# EAGLE board GC_LINE_2026_INCHEON (EAGLE 9.7.0), part 1 of 2
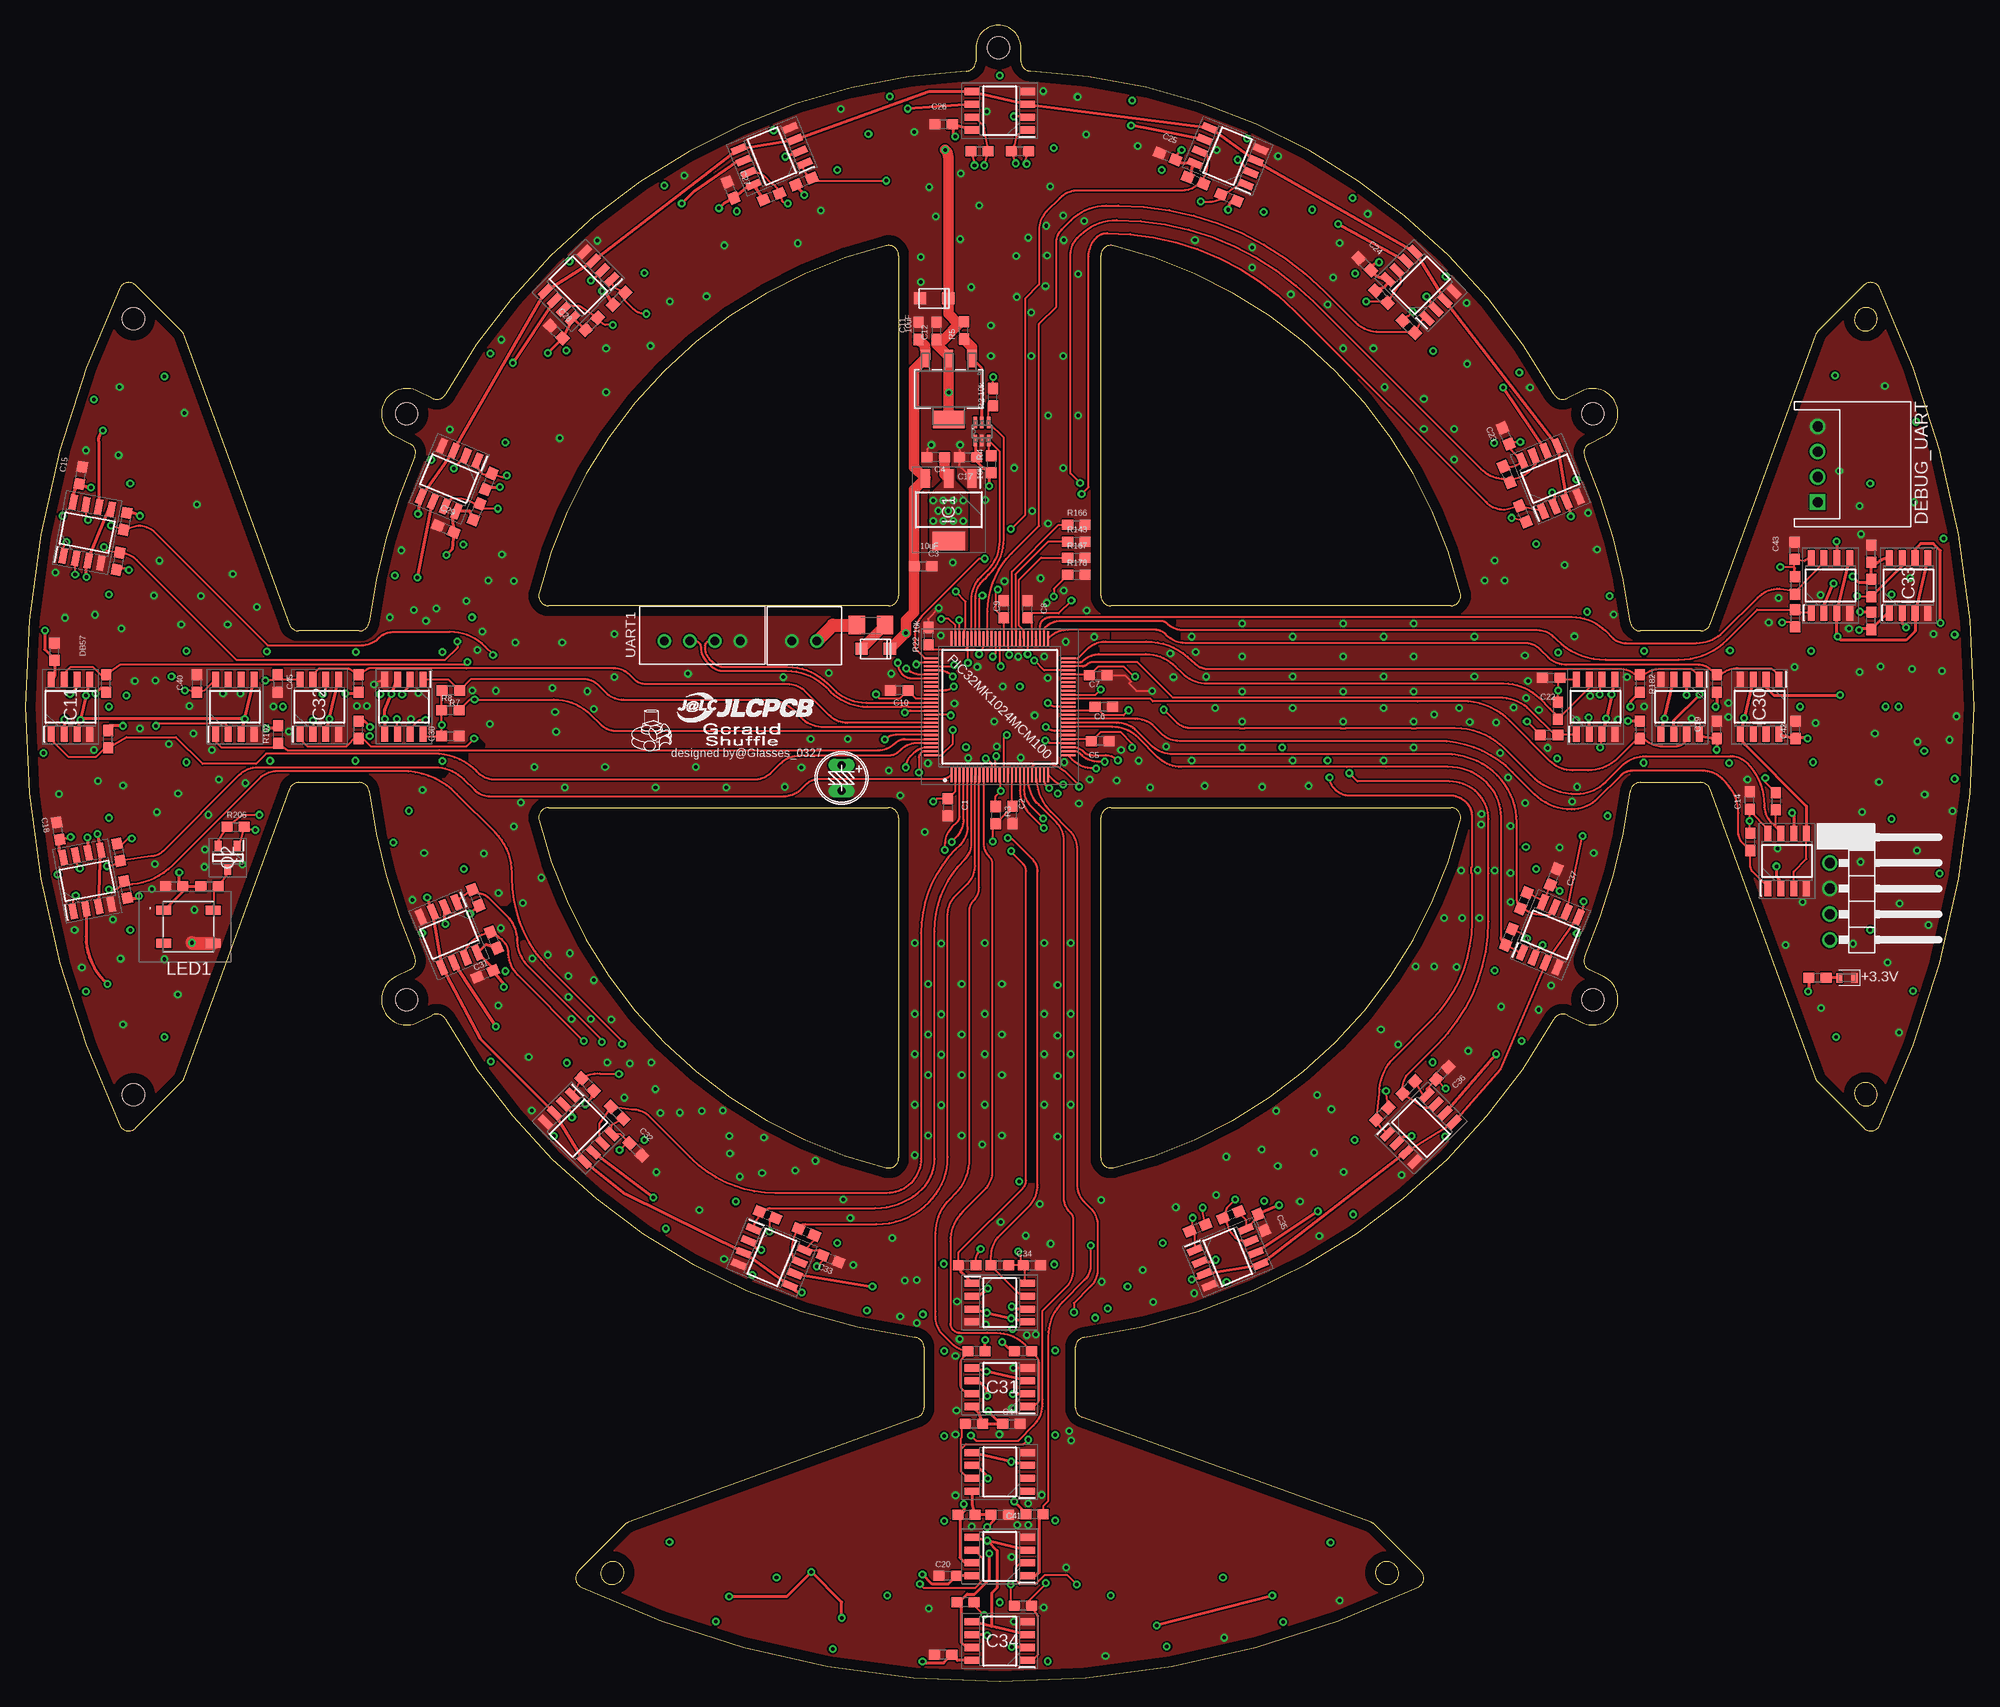
[diagram p5: board, top side]
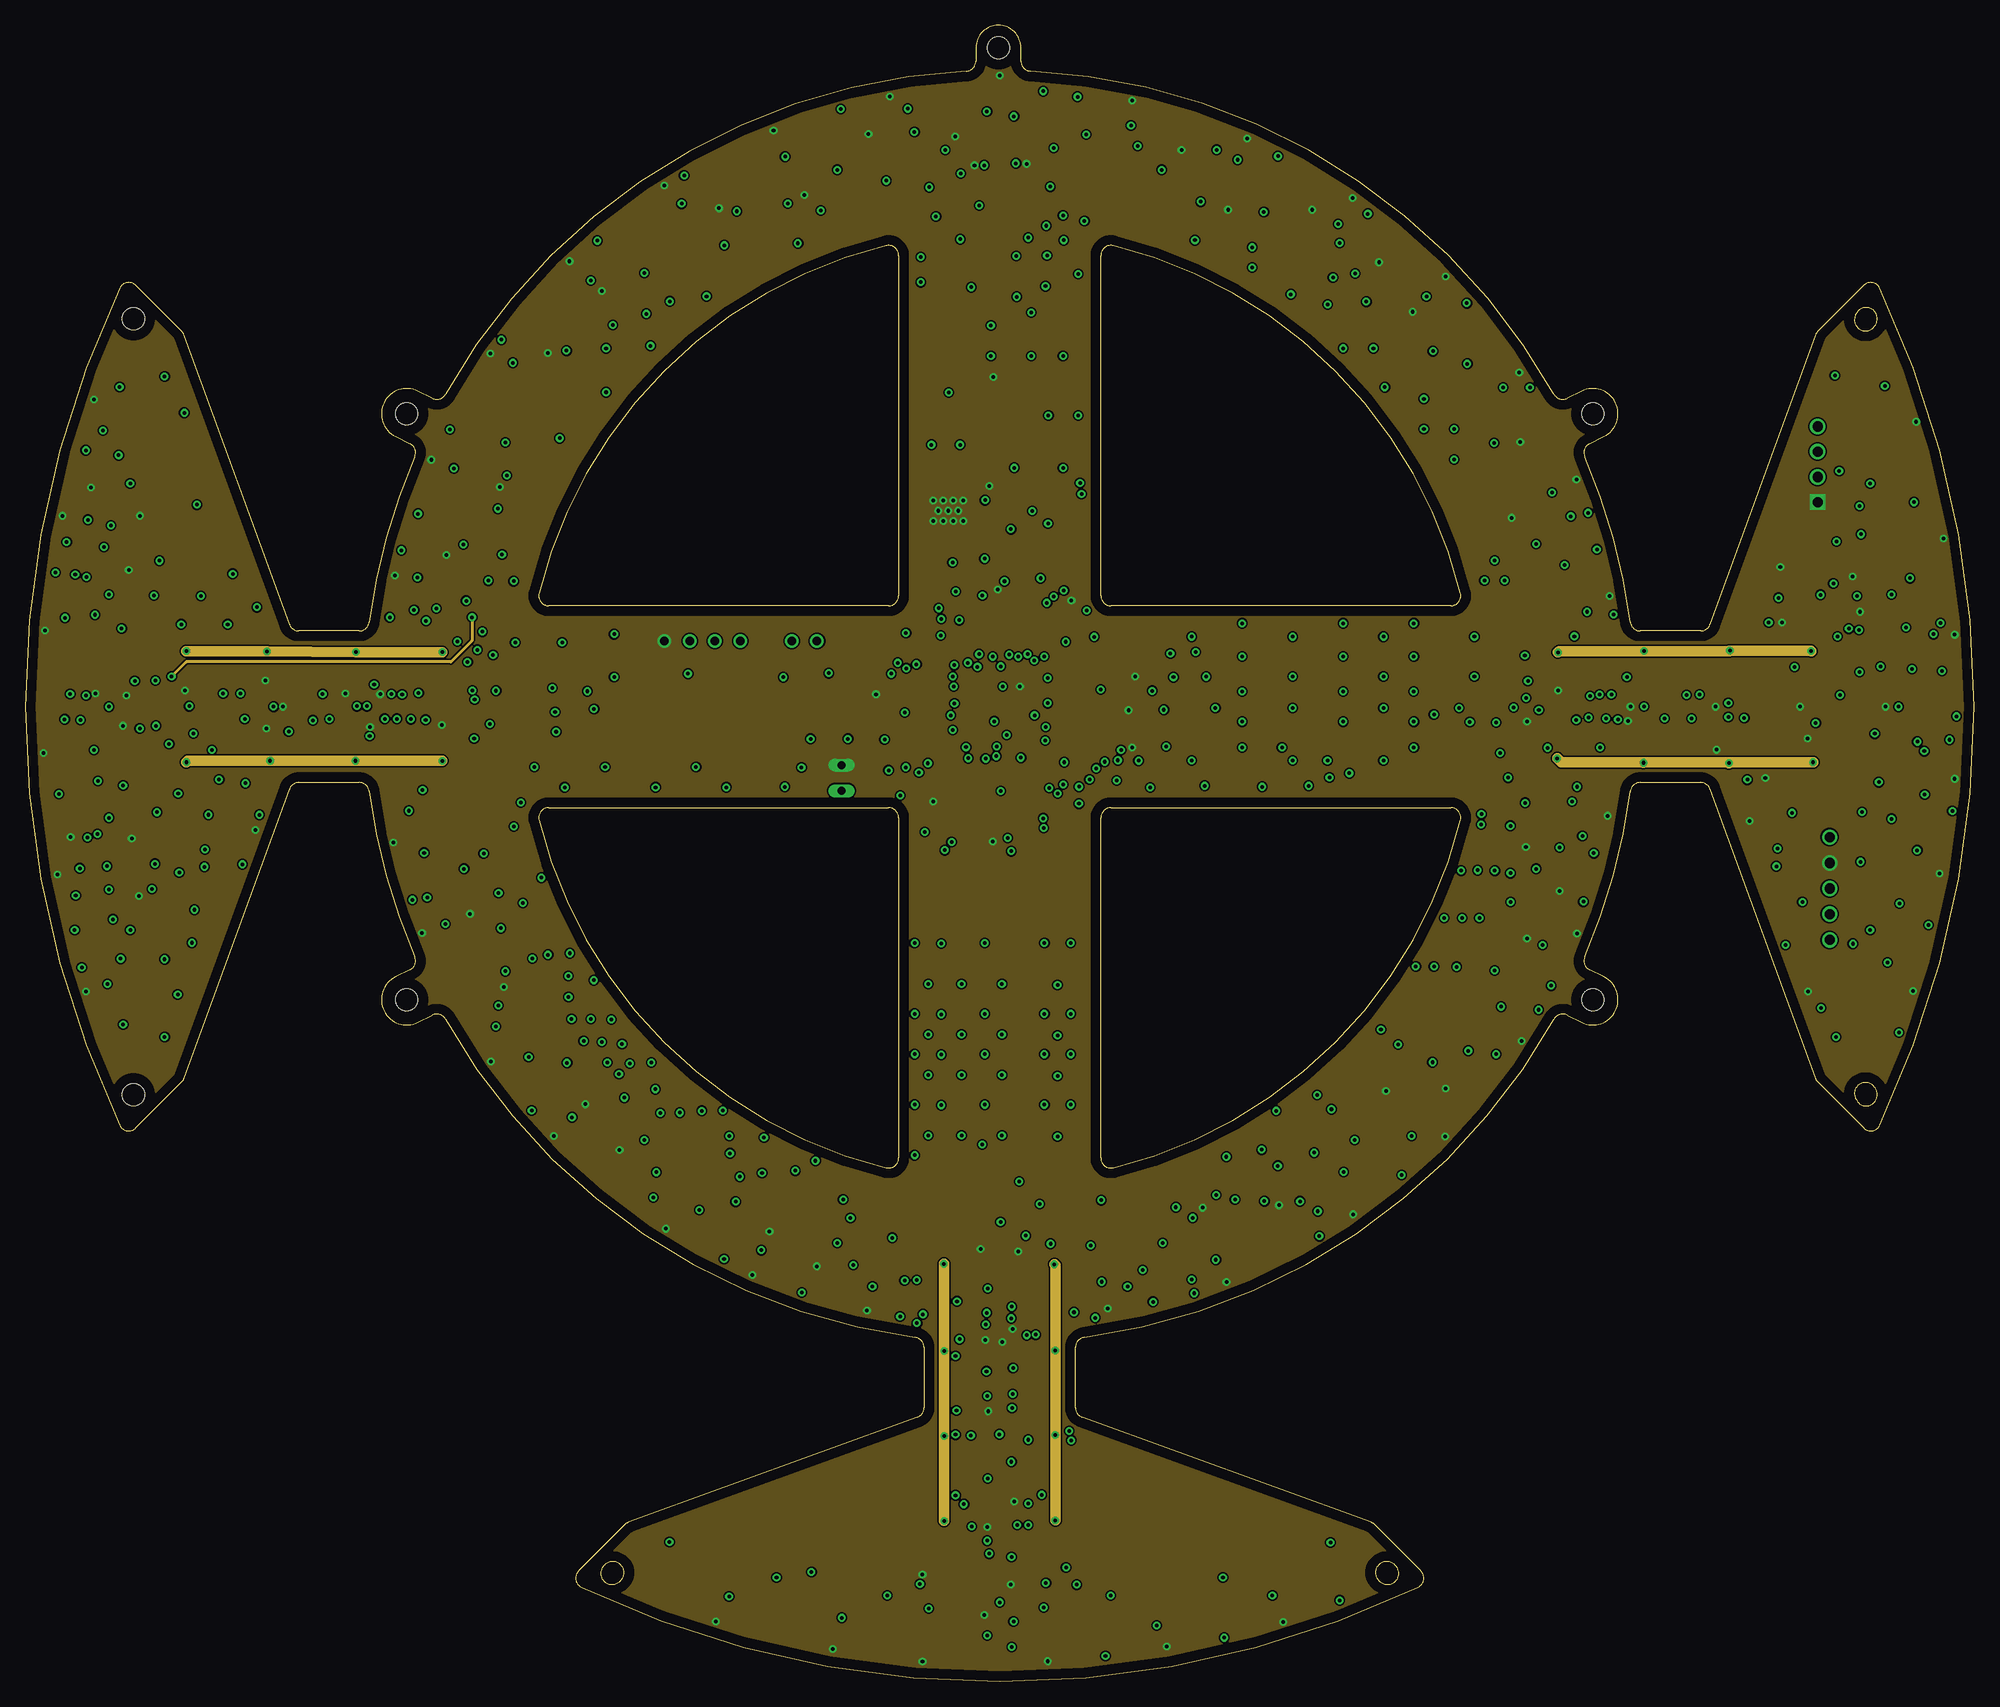
[diagram p6: board, inner layer Route2]
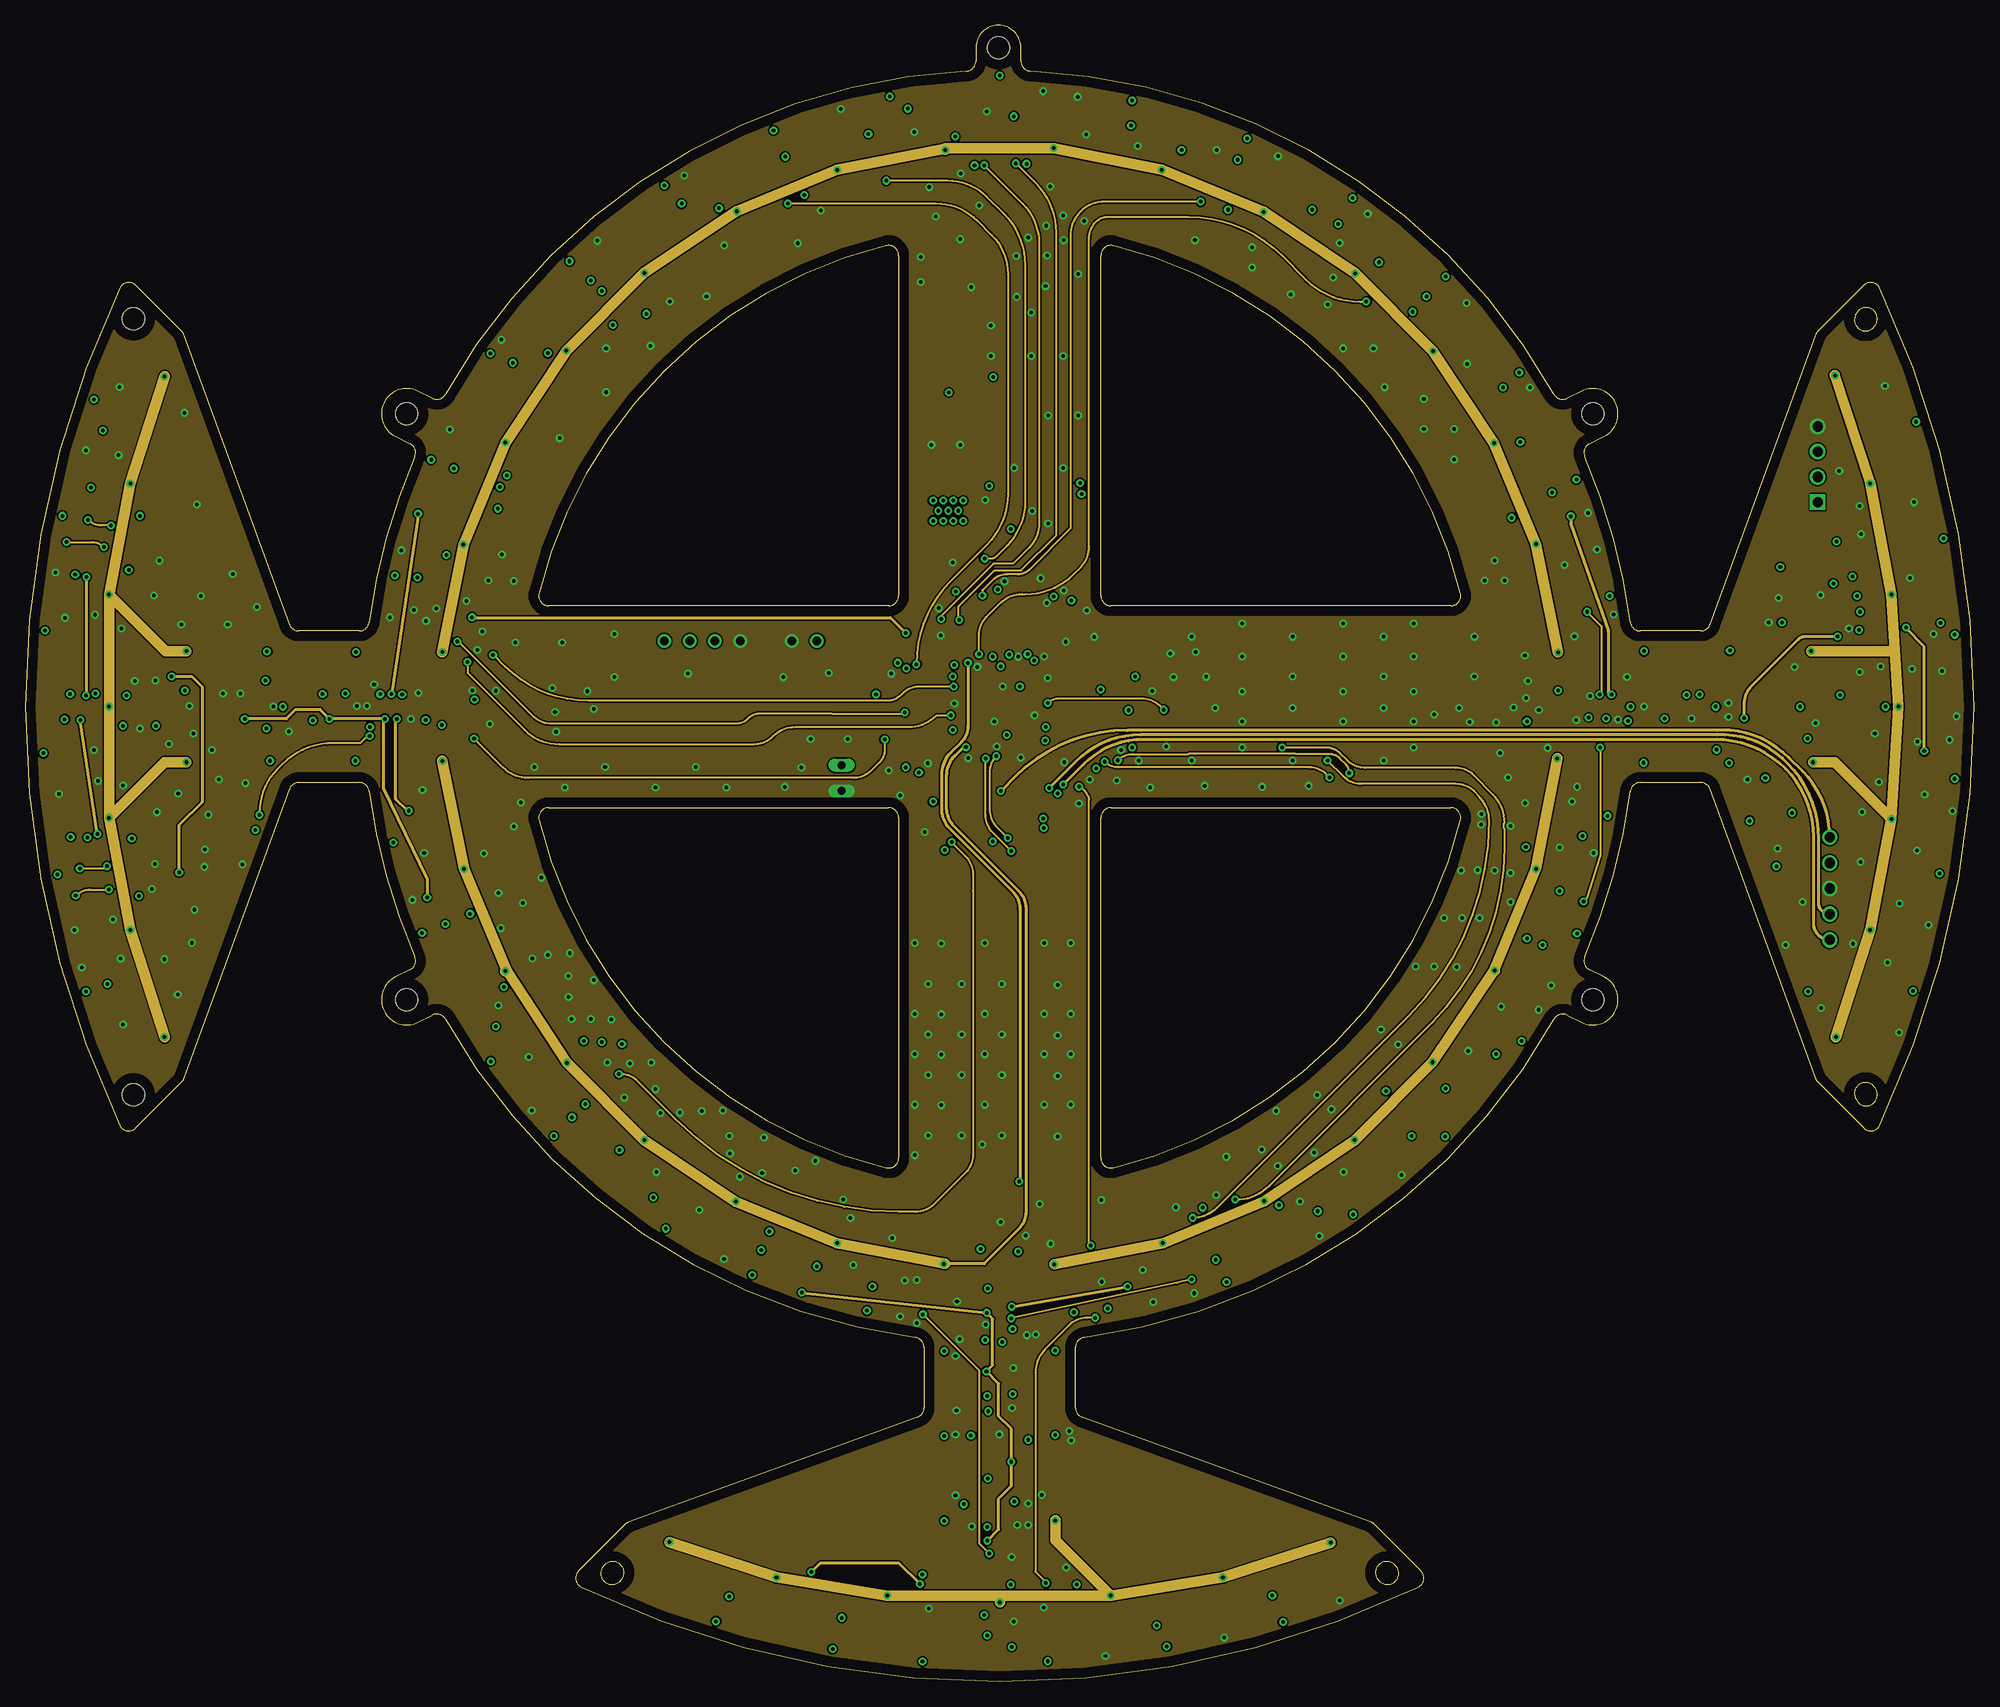
[diagram p7: board, inner layer Route15]
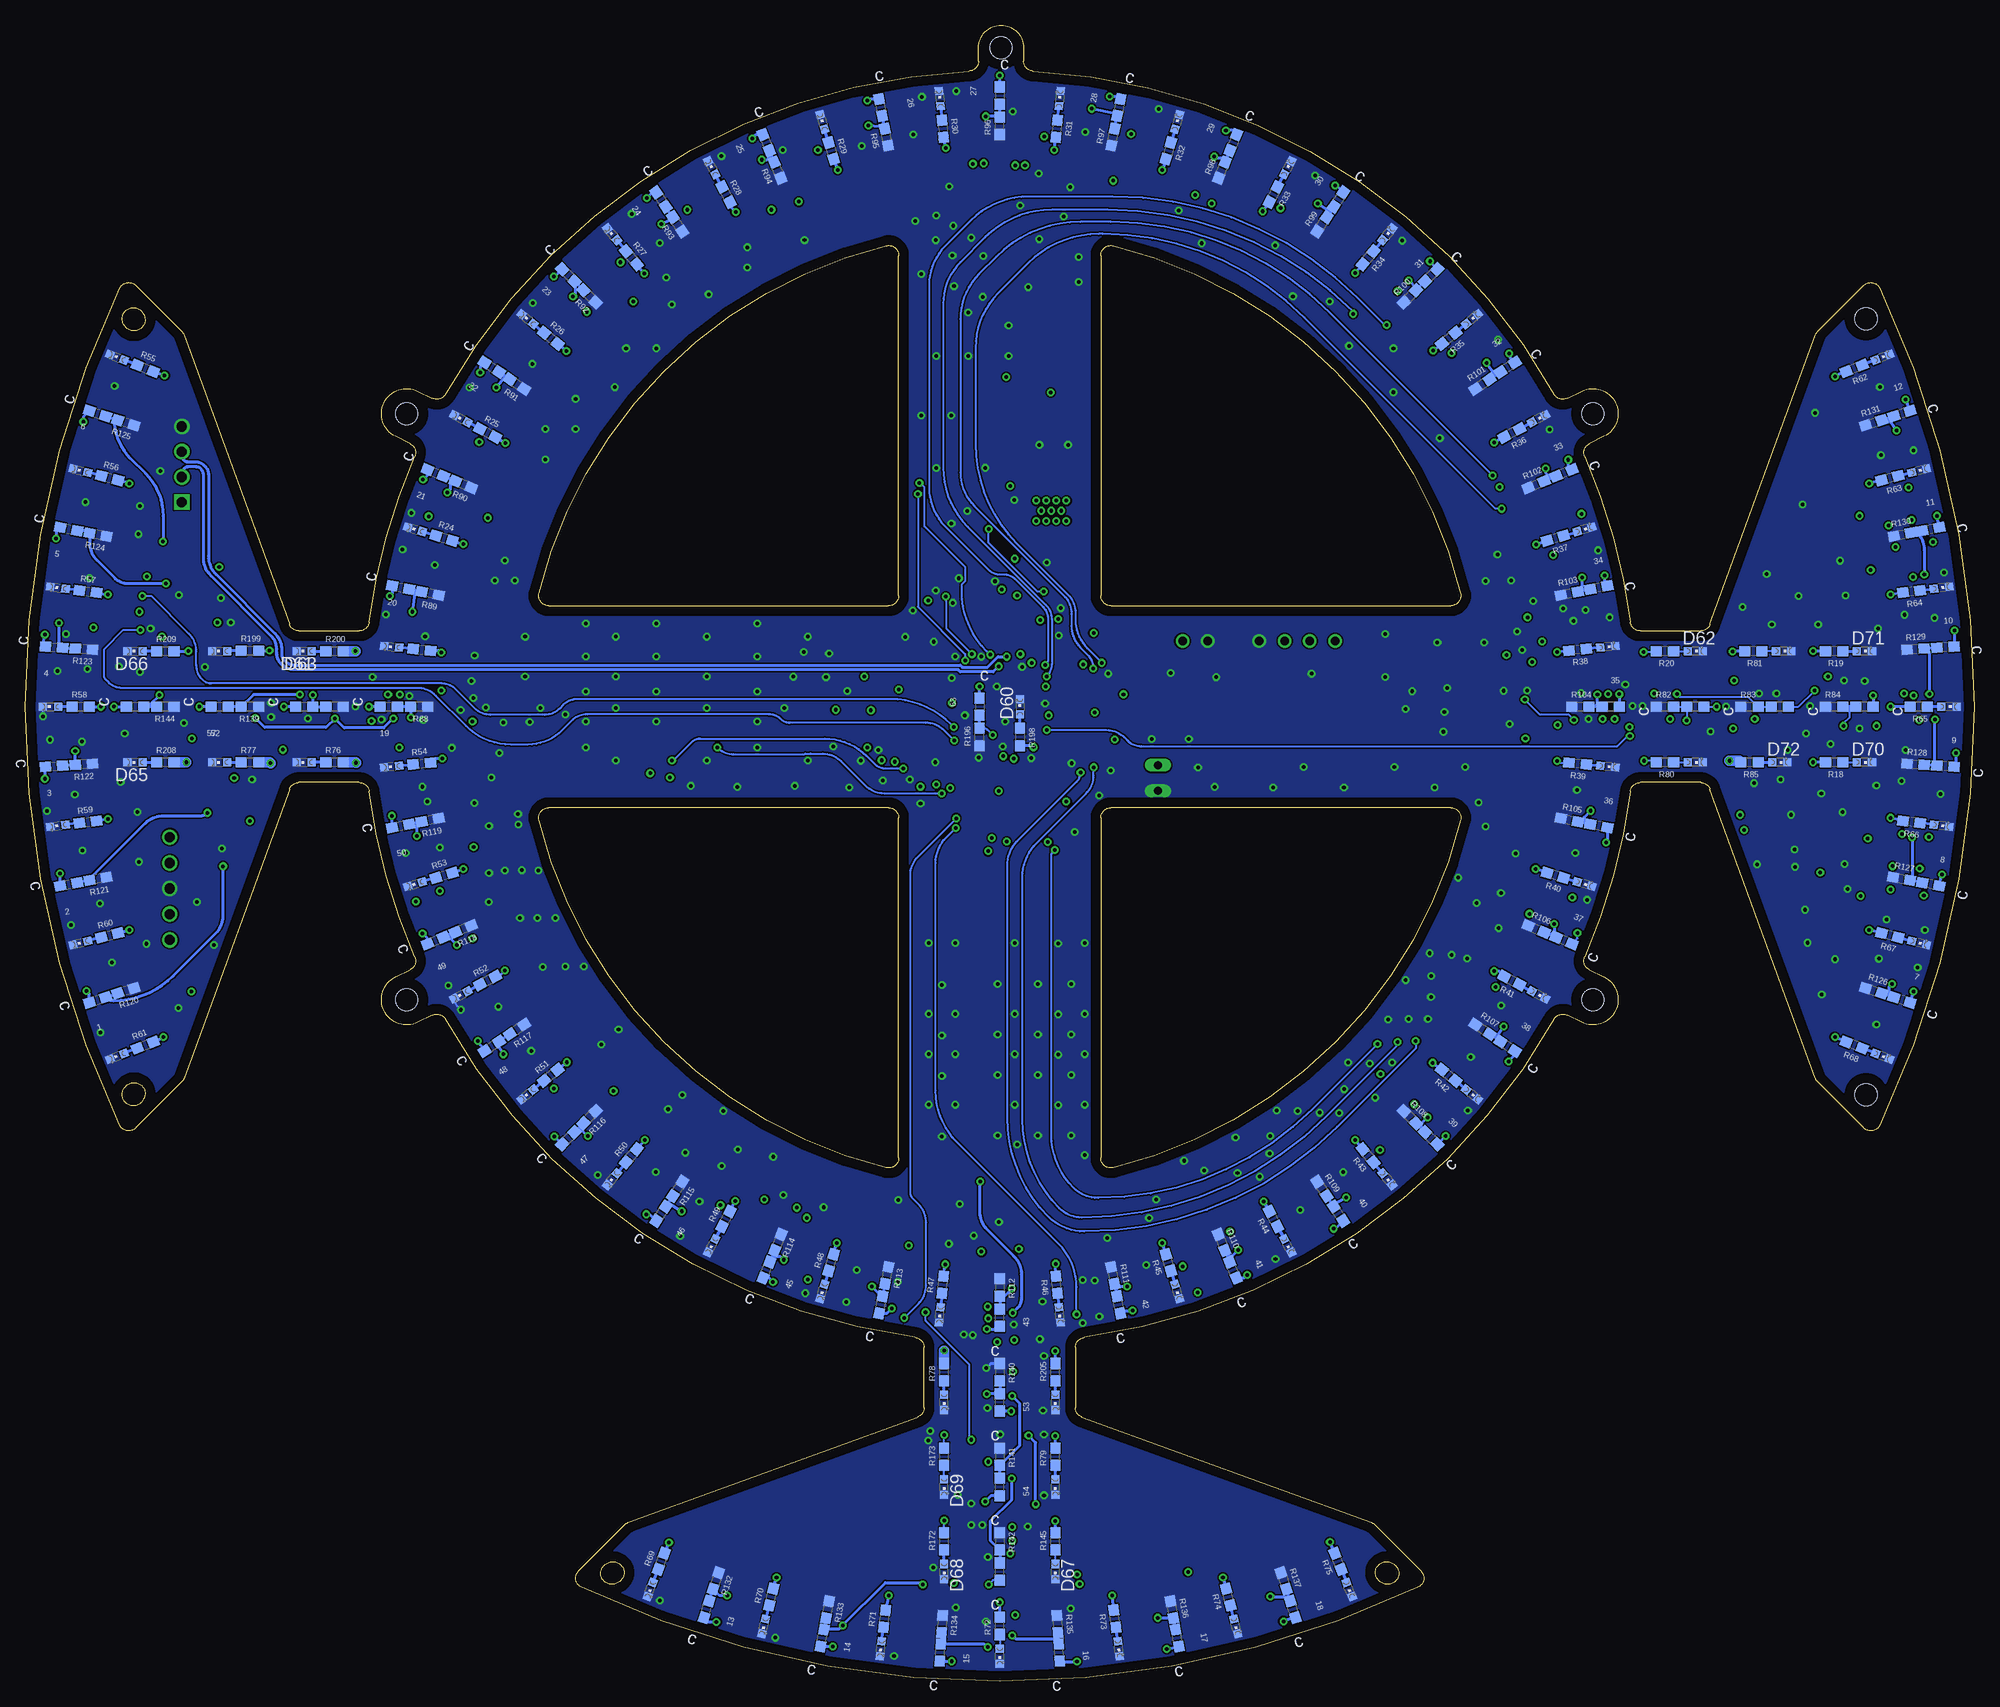
[diagram p8: board, bottom side, seen from below]

Size 193 x 163.96 mm. Coordinates in mm from the lower left corner, seen from the top.
Outline: 138.2,10.95 133.65,15.51 arc25 133.29,15.74 104.66,26.16 arc-70 104,27.1 104,33.07 arc-82 104.87,34.06 arc53 151.38,65.56 arc-87 152.69,65.96 154.12,65.26 arc180 156.34,69.74 154.91,70.45 arc-87 154.43,71.74 arc16 158.94,88.13 arc-82 159.93,89 165.9,89 arc-70 166.84,88.34 177.26,59.71 arc25 177.49,59.35 182.04,54.79 arc110 183.65,55.07 arc51 183.65,137.93 arc110 182.04,138.2 177.49,133.65 arc25 177.26,133.29 166.84,104.66 arc-70 165.9,104 159.93,104 arc-82 158.94,104.87 arc16 154.43,121.26 arc-87 154.91,122.55 156.34,123.26 arc180 154.12,127.74 152.69,127.03 arc-87 151.38,127.44 arc58 99.55,159.43 arc-87 98.6,160.42 98.6,161.73 arc180 94.13,161.73 94.13,160.41 arc-87 93.19,159.41 arc58 41.62,127.44 arc-87 40.31,127.03 38.88,127.74 arc180 36.66,123.26 38.09,122.55 arc-87 38.57,121.26 arc16 34.06,104.87 arc-82 33.07,104 27.1,104 arc-70 26.16,104.66 15.74,133.29 arc25 15.51,133.65 10.95,138.2 arc110 9.34,137.93 arc51 9.34,55.07 arc110 10.95,54.79 15.51,59.35 arc25 15.74,59.71 26.16,88.34 arc-70 27.1,89 33.07,89 arc-82 34.06,88.13 arc16 38.57,71.74 arc-87 38.09,70.45 36.66,69.74 arc180 38.88,65.26 40.31,65.96 arc-87 41.62,65.56 arc53 88.13,34.06 arc-82 89,33.07 89,27.1 arc-70 88.34,26.16 59.71,15.74 arc25 59.35,15.51 54.79,10.95 arc110 55.07,9.34 arc51 137.93,9.34 arc110 138.2,10.95
Outline: 107.5,86.5 arc90 106.5,85.5 106.5,51.83 arc104 107.74,50.86 arc62 142.14,85.26 arc104 141.16,86.5 107.5,86.5
Outline: 58.66,9.77 arc187 57.62,11.7 arc187 58.66,9.77
Outline: 181.3,57.62 arc187 183.23,58.66 arc187 181.3,57.62
Outline: 134.34,9.77 arc187 135.38,11.7 arc187 134.34,9.77
Outline: 141.16,106.5 arc104 142.14,107.74 arc62 107.74,142.14 arc104 106.5,141.16 106.5,107.5 arc90 107.5,106.5 141.16,106.5
Outline: 86.5,85.5 arc90 85.5,86.5 51.83,86.5 arc104 50.86,85.26 arc62 85.26,50.86 arc104 86.5,51.83 86.5,85.5
Outline: 183.23,134.34 arc187 181.3,135.38 arc187 183.23,134.34
Outline: 85.5,106.5 arc90 86.5,107.5 86.5,141.16 arc104 85.26,142.14 arc62 50.86,107.74 arc104 51.83,106.5 85.5,106.5
Copper layers (1+2*15+16): Top 0.035mm / dielectric 1.5mm / Route2 0.035mm / dielectric 0.15mm / Route15 0.035mm / dielectric 0.2mm / Bottom 0.035mm
Design rules "Fusion Electronics Design Rules *": minimum track width 6mil, minimum drill 0.35mm, track to track 6mil, track to pad 6mil, pad to pad 6mil, via to via 6mil, smd to smd 6mil, copper to edge 40mil, drill to drill 6mil, minimum pad ring 10mil, minimum via ring 8mil, stop-mask expansion 4mil, vias tented up to drill 0.36mm, thermal gap 10mil
Holes 2.2 mm at 155.23,125.5 155.23,67.5 10.71,134.92 37.77,125.5 96.37,161.73 37.77,67.5 10.71,58.08
tRestrict: 18 lines

## Footprints (pad centres in the part's own frame; a part is rotated, then mirrored left to right if it is on the bottom)
C1608 = smd 1.1 x 1: 1 -0.85,0; 2 0.85,0
LEDC1608X55N_FLAT-R = smd 0.612 x 0.912: A 0.75,0; C -0.75,0
CC:3 = drill 0.8 long: + -1.27,0; - 1.27,0
CHIPLED_0603 = smd 0.8 x 0.8: A 0,-0.75; C 0,0.75
S4B-XH-A = drill 1.016 square: 1 3.75,0 | drill 1.016: 2 1.25,0; 3 -1.25,0; 4 -3.75,0
SOT230P700X180-4N = smd 1.85 x 0.9: 1 -3.1,2.3; 2 -3.1,0; 3 -3.1,-2.3 | smd 1.85 x 3.2: 4 3.1,0
SOIC127P600X175-8N = smd 0.7 x 1.525: 1 -1.905,-2.712; 2 -0.635,-2.712; 3 0.635,-2.712; 4 1.905,-2.712; 5 1.905,2.712; 6 0.635,2.712; 7 -0.635,2.712; 8 -1.905,2.712
B2B-XH-A = drill 0.84: 1 0,0; 2 2.5,0
WS2812BB = smd 1.5 x 0.9: 1 -2.45,1.65; 2 -2.45,-1.65; 3 2.45,-1.65; 4 2.45,1.65
1X05L = drill 1.016: 1 -5.08,-3.81; 2 -2.54,-3.81; 3 0,-3.81; 4 2.54,-3.81; 5 5.08,-3.81
QFP40P1400X1400X120-100N = smd 1.475 x 0.2: 1 -6.738,4.8; 2 -6.738,4.4; 3 -6.738,4; 4 -6.738,3.6; 5 -6.738,3.2; 6 -6.738,2.8; 7 -6.738,2.4; 8 -6.738,2; 9 -6.738,1.6; 10 -6.738,1.2; 11 -6.738,0.8; 12 -6.738,0.4; 13 -6.738,0; 14 -6.738,-0.4; 15 -6.738,-0.8; 16 -6.738,-1.2; 17 -6.738,-1.6; 18 -6.738,-2; 19 -6.738,-2.4; 20 -6.738,-2.8; 21 -6.738,-3.2; 22 -6.738,-3.6; 23 -6.738,-4; 24 -6.738,-4.4; 25 -6.738,-4.8; 51 6.738,-4.8; 52 6.738,-4.4; 53 6.738,-4; 54 6.738,-3.6; 55 6.738,-3.2; 56 6.738,-2.8; 57 6.738,-2.4; 58 6.738,-2; 59 6.738,-1.6; 60 6.738,-1.2; 61 6.738,-0.8; 62 6.738,-0.4; 63 6.738,0; 64 6.738,0.4; 65 6.738,0.8; 66 6.738,1.2; 67 6.738,1.6; 68 6.738,2; 69 6.738,2.4; 70 6.738,2.8; 71 6.738,3.2; 72 6.738,3.6; 73 6.738,4; 74 6.738,4.4; 75 6.738,4.8 | smd 0.2 x 1.475: 26 -4.8,-6.738; 27 -4.4,-6.738; 28 -4,-6.738; 29 -3.6,-6.738; 30 -3.2,-6.738; 31 -2.8,-6.738; 32 -2.4,-6.738; 33 -2,-6.738; 34 -1.6,-6.738; 35 -1.2,-6.738; 36 -0.8,-6.738; 37 -0.4,-6.738; 38 0,-6.738; 39 0.4,-6.738; 40 0.8,-6.738; 41 1.2,-6.738; 42 1.6,-6.738; 43 2,-6.738; 44 2.4,-6.738; 45 2.8,-6.738; 46 3.2,-6.738; 47 3.6,-6.738; 48 4,-6.738; 49 4.4,-6.738; 50 4.8,-6.738; 76 4.8,6.738; 77 4.4,6.738; 78 4,6.738; 79 3.6,6.738; 80 3.2,6.738; 81 2.8,6.738; 82 2.4,6.738; 83 2,6.738; 84 1.6,6.738; 85 1.2,6.738; 86 0.8,6.738; 87 0.4,6.738; 88 0,6.738; 89 -0.4,6.738; 90 -0.8,6.738; 91 -1.2,6.738; 92 -1.6,6.738; 93 -2,6.738; 94 -2.4,6.738; 95 -2.8,6.738; 96 -3.2,6.738; 97 -3.6,6.738; 98 -4,6.738; 99 -4.4,6.738; 100 -4.8,6.738
SOT95P240X120-3N = smd 1 x 0.7: 1 -1.2,0.95; 2 -1.2,-0.95; 3 1.2,0
R1608 = smd 1.1 x 1: 1 -0.85,0; 2 0.85,0
SOT-223_DIO = smd 0.851 x 1.761: 1 -2.3,-3.025; 2 0,-3.025; 3 2.3,-3.025 | smd 3.151 x 1.761: 4 0,3.025
R3216 = smd 1.6 x 1.8: 1 -1.4,0; 2 1.4,0
SOT65P210X110-6N = smd 1.168 x 0.356: 1 -0.889,0.66; 2 -0.889,0; 3 -0.889,-0.66; 4 0.889,-0.66; 5 0.889,0; 6 0.889,0.66
SDO-123FL = smd 1.2 x 1.2: P$1 -1.4,0.1; P$2 1.4,0.1
B4B-XH-A = drill 0.84: 1 0,0; 2 2.5,0; 3 5,0; 4 7.5,0

## Placement (x,y rotation side)
1  ALS-PT19-315C/L177/TR8C1608  [C1608]  185.85,67.47 18 bottom
2  ALS-PT19-315C/L177/TR8C1608  [C1608]  188.7,78.92 10.8 bottom
3  ALS-PT19-315C/L177/TR8C1608  [C1608]  190.14,90.61 3.6 bottom
4  ALS-PT19-315C/L177/TR8C1608  [C1608]  190.14,102.39 356.4 bottom
5  ALS-PT19-315C/L177/TR8C1608  [C1608]  188.7,114.08 349.2 bottom
6  ALS-PT19-315C/L177/TR8C1608  [C1608]  185.85,125.53 342 bottom
7  ALS-PT19-315C/L177/TR8C1608  [C1608]  7.15,67.47 162 bottom
8  ALS-PT19-315C/L177/TR8C1608  [C1608]  4.3,78.92 169.2 bottom
9  ALS-PT19-315C/L177/TR8C1608  [C1608]  2.86,90.61 176.4 bottom
10  ALS-PT19-315C/L177/TR8C1608  [C1608]  2.86,102.39 183.6 bottom
11  ALS-PT19-315C/L177/TR8C1608  [C1608]  4.3,114.08 190.8 bottom
12  ALS-PT19-315C/L177/TR8C1608  [C1608]  7.15,125.53 198 bottom
13  ALS-PT19-315C/L177/TR8C1608  [C1608]  125.53,7.15 72 bottom
14  ALS-PT19-315C/L177/TR8C1608  [C1608]  114.08,4.3 79.2 bottom
15  ALS-PT19-315C/L177/TR8C1608  [C1608]  102.39,2.86 86.4 bottom
16  ALS-PT19-315C/L177/TR8C1608  [C1608]  90.61,2.86 93.6 bottom
17  ALS-PT19-315C/L177/TR8C1608  [C1608]  78.92,4.3 100.8 bottom
18  ALS-PT19-315C/L177/TR8C1608  [C1608]  67.47,7.15 108 bottom
19  ALS-PT19-315C/L177/TR8C1608  [C1608]  157,96.5 0 bottom
20  ALS-PT19-315C/L177/TR8C1608  [C1608]  155.82,108.3 348.7 bottom
21  ALS-PT19-315C/L177/TR8C1608  [C1608]  152.39,119.65 337.5 bottom
22  ALS-PT19-315C/L177/TR8C1608  [C1608]  146.8,130.11 326.2 bottom
23  ALS-PT19-315C/L177/TR8C1608  [C1608]  139.21,139.21 315 bottom
24  ALS-PT19-315C/L177/TR8C1608  [C1608]  130.05,146.72 303.7 bottom
25  ALS-PT19-315C/L177/TR8C1608  [C1608]  119.63,152.35 292.5 bottom
26  ALS-PT19-315C/L177/TR8C1608  [C1608]  108.3,155.83 281.2 bottom
27  ALS-PT19-315C/L177/TR8C1608  [C1608]  96.5,157 270 bottom
28  ALS-PT19-315C/L177/TR8C1608  [C1608]  84.7,155.83 258.7 bottom
29  ALS-PT19-315C/L177/TR8C1608  [C1608]  73.37,152.35 247.5 bottom
30  ALS-PT19-315C/L177/TR8C1608  [C1608]  62.95,146.72 236.2 bottom
31  ALS-PT19-315C/L177/TR8C1608  [C1608]  53.79,139.21 225 bottom
32  ALS-PT19-315C/L177/TR8C1608  [C1608]  46.2,130.11 213.7 bottom
33  ALS-PT19-315C/L177/TR8C1608  [C1608]  40.61,119.65 202.5 bottom
34  ALS-PT19-315C/L177/TR8C1608  [C1608]  37.18,108.3 191.2 bottom
35  ALS-PT19-315C/L177/TR8C1608  [C1608]  36,96.5 180 bottom
36  ALS-PT19-315C/L177/TR8C1608  [C1608]  37.18,84.7 168.7 bottom
37  ALS-PT19-315C/L177/TR8C1608  [C1608]  40.61,73.35 157.5 bottom
38  ALS-PT19-315C/L177/TR8C1608  [C1608]  46.2,62.89 146.2 bottom
39  ALS-PT19-315C/L177/TR8C1608  [C1608]  53.78,53.79 135 bottom
40  ALS-PT19-315C/L177/TR8C1608  [C1608]  62.96,46.31 123.7 bottom
41  ALS-PT19-315C/L177/TR8C1608  [C1608]  73.4,40.74 112.5 bottom
42  ALS-PT19-315C/L177/TR8C1608  [C1608]  84.73,37.3 101.2 bottom
43  ALS-PT19-315C/L177/TR8C1608  [C1608]  96.5,36 90 bottom
44  ALS-PT19-315C/L177/TR8C1608  [C1608]  108.27,37.3 78.7 bottom
45  ALS-PT19-315C/L177/TR8C1608  [C1608]  119.6,40.74 67.5 bottom
46  ALS-PT19-315C/L177/TR8C1608  [C1608]  130.04,46.31 56.2 bottom
47  ALS-PT19-315C/L177/TR8C1608  [C1608]  139.22,53.79 45 bottom
48  ALS-PT19-315C/L177/TR8C1608  [C1608]  146.8,62.89 33.7 bottom
49  ALS-PT19-315C/L177/TR8C1608  [C1608]  152.39,73.35 22.5 bottom
50  ALS-PT19-315C/L177/TR8C1608  [C1608]  155.82,84.7 11.2 bottom
51  ALS-PT19-315C/L177/TR8C1608  [C1608]  165.37,96.5 0 bottom
52  ALS-PT19-315C/L177/TR8C1608  [C1608]  173.75,96.5 0 bottom
53  ALS-PT19-315C/L177/TR8C1608  [C1608]  96.5,27.62 90 bottom
54  ALS-PT19-315C/L177/TR8C1608  [C1608]  96.5,19.25 90 bottom
55  ALS-PT19-315C/L177/TR8C1608  [C1608]  96.5,10.87 90 bottom
57  ALS-PT19-315C/L177/TR8C1608  [C1608]  182.12,96.5 0 bottom
59  ALS-PT19-315C/L177/TR8C1608  [C1608]  27.62,96.5 180 bottom
60  ALS-PT19-315C/L177/TR8C1608  [C1608]  19.25,96.5 180 bottom
61  ALS-PT19-315C/L177/TR8C1608  [C1608]  10.87,96.5 180 bottom
63  ALS-PT19-315C/L177/TR8C1608  [C1608]  98.5,96.5 270 bottom
+3.3V  RED  [LEDC1608X55N_FLAT-R]  180.4,69.65 180 top
C1  0.1uF  [C1608]  91.35,86.55 270 top
C2  0.1uF  [C1608]  97.76,85.79 90 top
C3  10uF  [C1608]  88.92,110.4 0 top
C4  22uf  [C1608]  90.17,121.2 180 top
C5  0.1uF  [C1608]  106.45,93.1 180 top
C6  0.1uF  [C1608]  106.8,96.5 0 top
C7  0.1uF  [C1608]  106.25,99.6 0 top
C8  0.1uF  [C1608]  99.25,106.15 90 top
C9  0.1uF  [C1608]  96.9,106.15 270 top
C10  0.1uF  [C1608]  86.55,98.1 180 top
C11  10uF  [C1608]  88.45,133.7 90 top
C12  22uf  [C1608]  90.25,133.7 90 top
C14  0.1uF  [C1608]  170.76,87.21 90 top
C15  0.1uF  [C1608]  5.5,119.4 80 top
C17  0.1uF  [C1608]  93.35,121.2 0 top
C18  0.1uF  [C1608]  3.25,84.2 100 top
C19  0.1uF  [C1608]  167.5,94.2 90 top
C20  0.1uF  [C1608]  91.35,10.45 180 top
C22  0.1uF  [C1608]  151.1,99.35 180 top
C23  0.1uF  [C1608]  146.62,123.3 112.5 top
C24  0.1uF  [C1608]  132.65,140.3 135 top
C25  0.1uF  [C1608]  113.12,150.97 157.5 top
C26  0.1uF  [C1608]  90.95,154.15 180 top
C27  0.1uF  [C1608]  69.85,147.65 112.5 top
C28  0.1uF  [C1608]  52.6,133.6 135 top
C29  0.1uF  [C1608]  41.65,114.1 157.5 top
C30  0.1uF  [C1608]  42.1,93.6 0 top
C31  0.1uF  [C1608]  45.55,70.05 202.5 top
C32  0.1uF  [C1608]  60.45,52.67 315 top
C33  0.1uF  [C1608]  79.75,41.85 337.5 top
C34  0.1uF  [C1608]  99.7,41.2 0 top
C35  0.1uF  [C1608]  122.4,45.45 292.5 top
C36  0.1uF  [C1608]  140.32,60.22 45 top
C37  0.1uF  [C1608]  151.35,79.65 67.5 top
C38  0.1uF  [C1608]  2.9,101.95 90 top
C39  22uf  [CC:3]  80.82,89.44 270 top
C40  0.1uF  [C1608]  17,98.8 90 top
C41  0.1uF  [C1608]  96.5,16.5 0 top
C42  0.1uF  [C1608]  175.3,94.2 90 top
C43  0.1uF  [C1608]  175.2,111.95 90 top
C44  0.1uF  [C1608]  97.65,25.5 0 top
C45  0.1uF  [C1608]  25,98.8 270 top
C46  0.1uF  [C1608]  182.8,111.65 90 top
C47  0.1uF  [C1608]  14.75,78.7 180 top
C48  0.1uF  [C1608]  90.9,2.65 180 top
D1  RED  [CHIPLED_0603]  165.37,91 90 bottom
D2  RED  [CHIPLED_0603]  183.9,131.1 68.4 bottom
D3  RED  [CHIPLED_0603]  187.55,119.88 75.6 bottom
D4  RED  [CHIPLED_0603]  189.76,108.28 82.8 bottom
D5  RED  [CHIPLED_0603]  190.5,96.5 90 bottom
D6  RED  [CHIPLED_0603]  189.76,84.72 97.2 bottom
D7  RED  [CHIPLED_0603]  187.55,73.12 104.4 bottom
D8  RED  [CHIPLED_0603]  183.9,61.9 111.6 bottom
D9  RED  [CHIPLED_0603]  9.1,131.1 291.6 bottom
D10  RED  [CHIPLED_0603]  5.45,119.88 284.4 bottom
D11  RED  [CHIPLED_0603]  3.24,108.28 277.2 bottom
D12  RED  [CHIPLED_0603]  2.5,96.5 270 bottom
D13  RED  [CHIPLED_0603]  3.24,84.72 262.8 bottom
D14  RED  [CHIPLED_0603]  5.45,73.12 255.6 bottom
D15  RED  [CHIPLED_0603]  9.1,61.9 248.4 bottom
D16  RED  [CHIPLED_0603]  131.1,9.1 159.4 bottom
D17  RED  [CHIPLED_0603]  119.88,5.45 166.6 bottom
D18  RED  [CHIPLED_0603]  108.28,3.24 173.8 bottom
D19  RED  [CHIPLED_0603]  96.5,2.5 180 bottom
D20  RED  [CHIPLED_0603]  156.71,102.43 84.4 bottom
D21  RED  [CHIPLED_0603]  154.39,114.06 73.1 bottom
D22  RED  [CHIPLED_0603]  149.86,125.02 61.9 bottom
D23  RED  [CHIPLED_0603]  143.27,134.88 50.6 bottom
D24  RED  [CHIPLED_0603]  134.88,143.27 39.4 bottom
D25  RED  [CHIPLED_0603]  125.02,149.86 28.1 bottom
D26  RED  [CHIPLED_0603]  114.06,154.39 16.9 bottom
D27  RED  [CHIPLED_0603]  102.43,156.71 5.6 bottom
D28  RED  [CHIPLED_0603]  90.57,156.71 354.4 bottom
D29  RED  [CHIPLED_0603]  78.94,154.39 343.1 bottom
D30  RED  [CHIPLED_0603]  67.98,149.86 331.9 bottom
D31  RED  [CHIPLED_0603]  58.12,143.27 320.6 bottom
D32  RED  [CHIPLED_0603]  49.73,134.88 309.4 bottom
D33  RED  [CHIPLED_0603]  43.14,125.02 298.1 bottom
D34  RED  [CHIPLED_0603]  38.61,114.06 286.9 bottom
D35  RED  [CHIPLED_0603]  36.29,102.43 275.6 bottom
D36  RED  [CHIPLED_0603]  36.29,90.57 264.4 bottom
D37  RED  [CHIPLED_0603]  38.61,78.94 253.1 bottom
D38  RED  [CHIPLED_0603]  43.14,67.98 241.9 bottom
D39  RED  [CHIPLED_0603]  49.73,58.12 230.6 bottom
D40  RED  [CHIPLED_0603]  58.12,49.73 219.4 bottom
D41  RED  [CHIPLED_0603]  67.98,43.14 208.1 bottom
D42  RED  [CHIPLED_0603]  78.94,38.61 196.9 bottom
D43  RED  [CHIPLED_0603]  90.57,36.29 185.6 bottom
D44  RED  [CHIPLED_0603]  102.43,36.29 174.4 bottom
D45  RED  [CHIPLED_0603]  114.06,38.61 163.1 bottom
D46  RED  [CHIPLED_0603]  125.02,43.14 151.9 bottom
D47  RED  [CHIPLED_0603]  134.88,49.73 140.6 bottom
D48  RED  [CHIPLED_0603]  143.27,58.12 129.4 bottom
D49  RED  [CHIPLED_0603]  149.86,67.98 118.1 bottom
D50  RED  [CHIPLED_0603]  154.39,78.94 106.9 bottom
D51  RED  [CHIPLED_0603]  156.71,90.57 95.6 bottom
D52  RED  [CHIPLED_0603]  84.72,3.24 187.2 bottom
D53  RED  [CHIPLED_0603]  73.12,5.45 194.4 bottom
D54  RED  [CHIPLED_0603]  61.9,9.1 201.6 bottom
D55  RED  [CHIPLED_0603]  173.75,91 90 bottom
D56  RED  [CHIPLED_0603]  102,27.62 180 bottom
D57  RED  [CHIPLED_0603]  91,19.25 180 bottom
D58  RED  [CHIPLED_0603]  27.62,91 270 bottom
D59  RED  [CHIPLED_0603]  18.87,102 270 bottom
D60  RED  [CHIPLED_0603]  94.5,96.5 0 bottom
D61  RED  [CHIPLED_0603]  173.75,102 90 bottom
D62  RED  [CHIPLED_0603]  27.62,102 270 bottom
D63  RED  [CHIPLED_0603]  165.37,102 90 bottom
D64  RED  [CHIPLED_0603]  91,27.62 180 bottom
D65  RED  [CHIPLED_0603]  182.12,91 90 bottom
D66  RED  [CHIPLED_0603]  182.12,102 90 bottom
D67  RED  [CHIPLED_0603]  91,10.87 180 bottom
D68  RED  [CHIPLED_0603]  102,10.87 180 bottom
D69  RED  [CHIPLED_0603]  102,19.25 180 bottom
D70  RED  [CHIPLED_0603]  10.87,91 270 bottom
D71  RED  [CHIPLED_0603]  10.87,102 270 bottom
D72  RED  [CHIPLED_0603]  19.25,91 270 bottom
DEBUG_UART  [S4B-XH-A]  177.5,120.5 270 top
IC1  AZ1117CH-3.3TRG1  [SOT230P700X180-4N]  91.45,116 270 top
IC2  LM393DR2G  [SOIC127P600X175-8N]  163.87,96.5 180 top
IC3  LM393DR2G  [SOIC127P600X175-8N]  20.75,96.5 0 top
IC5  LM393DR2G  [SOIC127P600X175-8N]  178.75,108.5 0 top
IC6  LM393DR2G  [SOIC127P600X175-8N]  6.13,79.26 10.8 top
IC8  LM393DR2G  [SOIC127P600X175-8N]  6.13,113.74 349.2 top
IC9  LM393DR2G  [SOIC127P600X175-8N]  96.5,12.37 90 top
IC11  LM393DR2G  [SOIC127P600X175-8N]  4.5,96.5 0 top
IC12  LM393DR2G  [SOIC127P600X175-8N]  155.5,96.5 0 top
IC13  LM393DR2G  [SOIC127P600X175-8N]  151.01,119.08 22.5 top
IC14  LM393DR2G  [SOIC127P600X175-8N]  138.22,138.22 45 top
IC15  LM393DR2G  [SOIC127P600X175-8N]  119.08,151.01 67.5 top
IC16  LM393DR2G  [SOIC127P600X175-8N]  96.5,155.5 90 top
IC17  LM393DR2G  [SOIC127P600X175-8N]  73.92,151.01 112.5 top
IC18  LM393DR2G  [SOIC127P600X175-8N]  54.78,138.22 135 top
IC19  LM393DR2G  [SOIC127P600X175-8N]  41.99,119.08 157.5 top
IC20  LM393DR2G  [SOIC127P600X175-8N]  37.5,96.5 180 top
IC21  LM393DR2G  [SOIC127P600X175-8N]  41.99,73.92 202.5 top
IC22  LM393DR2G  [SOIC127P600X175-8N]  54.78,54.78 225 top
IC23  LM393DR2G  [SOIC127P600X175-8N]  73.92,41.99 247.5 top
IC24  LM393DR2G  [SOIC127P600X175-8N]  96.5,37.5 270 top
IC25  LM393DR2G  [SOIC127P600X175-8N]  119.08,41.99 292.5 top
IC26  LM393DR2G  [SOIC127P600X175-8N]  138.22,54.78 315 top
IC27  LM393DR2G  [SOIC127P600X175-8N]  174.48,81.22 0 top
IC28  LM393DR2G  [SOIC127P600X175-8N]  151.01,73.92 337.5 top
IC29  LM393DR2G  [SOIC127P600X175-8N]  96.5,20.75 90 top
IC30  LM393DR2G  [SOIC127P600X175-8N]  171.75,96.5 180 top
IC31  LM393DR2G  [SOIC127P600X175-8N]  96.5,29.12 90 top
IC32  LM393DR2G  [SOIC127P600X175-8N]  29.12,96.5 0 top
IC33  LM393DR2G  [SOIC127P600X175-8N]  186.5,108.5 0 top
IC34  LM393DR2G  [SOIC127P600X175-8N]  96.5,4 90 top
J2  JST-XH-2PIN  [B2B-XH-A]  78.4,103 180 top
LED1  WS2812B-B  [WS2812BB]  16.16,74.72 0 top
MCLR  PINHD1X05L  [1X05L]  182.5,78.5 270 top
PIC32MK1024MCM100  PIC32MK1024MCM100T-E_PT  [QFP40P1400X1400X120-100N]  96.5,96.5 90 top
Q2  BSS138  [SOT95P240X120-3N]  20.05,81.55 270 top
R1  1k  [R1608]  177.47,69.66 180 top
R2  10k  [R1608]  95.82,127.15 90 top
R3  10k  [R1608]  96.1,85.77 270 top
R4  10k  [R1608]  95.65,120.5 270 top
R5  3.8k  [R1608]  92.95,133.75 90 top
R6  10k  [R1608]  150.9,93.7 180 top
R7  10k  [R1608]  42.15,98.1 180 top
R8  10k  [R1608]  42.1,96.15 0 top
R9  10k  [R1608]  44.6,77.6 292.5 top
R10  10k  [R1608]  46.4,73.4 112.5 top
R11  10k  [R1608]  55.7,59.1 315 top
R12  10k  [R1608]  151.75,96.1 270 top
R13  10k  [R1608]  58.6,56.3 135 top
R14  10k  [R1608]  148.3,115.6 292.5 top
R15  10k  [R1608]  146.7,119.5 292.5 top
R16  10k  [R1608]  137,134.1 135 top
R17  10k  [R1608]  134.3,137.1 315 top
R18  220  [R1608]  13.87,91 180 bottom
R19  220  [R1608]  13.87,102 180 bottom
R20  220  [R1608]  30.62,102 180 bottom
R21  10k  [R1608]  119.2,146.9 337.5 top
R22  10k  [R1608]  89.43,103.49 270 top
R23  220  [R1608]  153.72,102.14 354.4 bottom
R24  220  [R1608]  151.52,113.19 343.1 bottom
R25  220  [R1608]  147.21,123.61 331.9 bottom
R26  220  [R1608]  140.95,132.98 320.6 bottom
R27  220  [R1608]  132.98,140.95 309.4 bottom
R28  220  [R1608]  123.61,147.21 298.1 bottom
R29  220  [R1608]  113.19,151.52 286.9 bottom
R30  220  [R1608]  102.14,153.72 275.6 bottom
R31  220  [R1608]  90.86,153.72 264.4 bottom
R32  220  [R1608]  79.81,151.52 253.1 bottom
R33  220  [R1608]  69.39,147.21 241.9 bottom
R34  220  [R1608]  60.02,140.95 230.6 bottom
R35  220  [R1608]  52.05,132.98 219.4 bottom
R36  220  [R1608]  45.79,123.61 208.1 bottom
R37  220  [R1608]  41.48,113.19 196.9 bottom
R38  220  [R1608]  39.28,102.14 185.6 bottom
R39  220  [R1608]  39.28,90.86 174.4 bottom
R40  220  [R1608]  41.48,79.81 163.1 bottom
R41  220  [R1608]  45.79,69.39 151.9 bottom
R42  220  [R1608]  52.05,60.02 140.6 bottom
R43  220  [R1608]  60.02,52.05 129.5 bottom
R44  220  [R1608]  69.39,45.79 118.1 bottom
R45  220  [R1608]  79.81,41.48 106.9 bottom
R46  220  [R1608]  90.86,39.28 95.6 bottom
R47  220  [R1608]  102.14,39.28 84.4 bottom
R48  220  [R1608]  113.19,41.48 73.1 bottom
R49  220  [R1608]  123.61,45.79 61.9 bottom
R50  220  [R1608]  132.98,52.05 50.6 bottom
R51  220  [R1608]  140.95,60.02 39.4 bottom
R52  220  [R1608]  147.21,69.39 28.1 bottom
R53  220  [R1608]  151.52,79.81 16.9 bottom
R54  220  [R1608]  153.72,90.86 5.6 bottom
R55  220  [R1608]  181.11,130 338.4 bottom
R56  220  [R1608]  184.64,119.13 345.6 bottom
R57  220  [R1608]  186.78,107.9 352.8 bottom
R58  220  [R1608]  187.5,96.5 0 bottom
R59  220  [R1608]  186.78,85.09 7.2 bottom
R60  220  [R1608]  184.64,73.87 14.4 bottom
R61  220  [R1608]  181.11,63 21.6 bottom
R62  220  [R1608]  11.89,130 201.6 bottom
R63  220  [R1608]  8.36,119.13 194.4 bottom
R64  220  [R1608]  6.22,107.9 187.2 bottom
R65  220  [R1608]  5.5,96.5 180 bottom
R66  220  [R1608]  6.22,85.09 172.8 bottom
R67  220  [R1608]  8.36,73.87 165.6 bottom
R68  220  [R1608]  11.89,63 158.4 bottom
R69  220  [R1608]  130,11.89 69.4 bottom
R70  220  [R1608]  119.13,8.36 76.6 bottom
R71  220  [R1608]  107.9,6.22 83.8 bottom
R72  220  [R1608]  96.5,5.5 90 bottom
R73  220  [R1608]  85.09,6.22 97.2 bottom
R74  220  [R1608]  73.87,8.36 104.4 bottom
R75  220  [R1608]  63,11.89 111.6 bottom
R76  220  [R1608]  162.37,91 0 bottom
R77  220  [R1608]  170.75,91 0 bottom
R78  220  [R1608]  102,30.62 90 bottom
R79  220  [R1608]  91,22.25 90 bottom
R80  220  [R1608]  30.62,91 180 bottom
R81  220  [R1608]  21.87,102 180 bottom
R82  64k  [R1608]  30.62,96.5 0 bottom
R83  64k  [R1608]  22.25,96.5 0 bottom
R84  64k  [R1608]  13.87,96.5 0 bottom
R85  220  [R1608]  22.25,91 180 bottom
R86  10k  [R1608]  115.9,148.6 337.5 top
R87  10k  [R1608]  98.5,151.5 0 top
R88  64k  [R1608]  154,96.5 180 bottom
R89  64k  [R1608]  152.9,107.72 168.7 bottom
R90  64k  [R1608]  149.62,118.5 157.5 bottom
R91  64k  [R1608]  144.31,128.45 146.2 bottom
R92  64k  [R1608]  137.12,137.12 135 bottom
R93  64k  [R1608]  128.41,144.26 123.7 bottom
R94  64k  [R1608]  118.5,149.62 112.5 bottom
R95  64k  [R1608]  107.72,152.9 101.2 bottom
R96  64k  [R1608]  96.5,154 90 bottom
R97  64k  [R1608]  85.28,152.9 78.7 bottom
R98  64k  [R1608]  74.5,149.62 67.5 bottom
R99  64k  [R1608]  64.59,144.26 56.2 bottom
R100  64k  [R1608]  55.88,137.12 45 bottom
R101  64k  [R1608]  48.69,128.45 33.7 bottom
R102  64k  [R1608]  43.38,118.5 22.5 bottom
R103  64k  [R1608]  40.1,107.72 11.2 bottom
R104  64k  [R1608]  39,96.5 0 bottom
R105  64k  [R1608]  40.1,85.28 348.7 bottom
R106  64k  [R1608]  43.38,74.5 337.6 bottom
R107  64k  [R1608]  48.69,64.55 326.2 bottom
R108  64k  [R1608]  55.87,55.87 315 bottom
R109  64k  [R1608]  64.6,48.76 303.7 bottom
R110  64k  [R1608]  74.53,43.47 292.5 bottom
R111  64k  [R1608]  85.3,40.2 281.2 bottom
R112  64k  [R1608]  96.5,39 270 bottom
R113  64k  [R1608]  107.7,40.2 258.7 bottom
R114  64k  [R1608]  118.47,43.47 247.5 bottom
R115  64k  [R1608]  128.4,48.76 236.2 bottom
R116  64k  [R1608]  137.13,55.87 225 bottom
R117  64k  [R1608]  144.31,64.55 213.7 bottom
R118  64k  [R1608]  149.62,74.5 202.5 bottom
R119  64k  [R1608]  152.9,85.28 191.2 bottom
R120  64k  [R1608]  183.04,68.38 198 bottom
R121  64k  [R1608]  185.8,79.47 190.8 bottom
R122  64k  [R1608]  187.19,90.79 183.6 bottom
R123  64k  [R1608]  187.19,102.21 176.4 bottom
R124  64k  [R1608]  185.8,113.53 169.2 bottom
R125  64k  [R1608]  183.04,124.62 162 bottom
R126  64k  [R1608]  9.96,68.38 342 bottom
R127  64k  [R1608]  7.2,79.47 349.2 bottom
R128  64k  [R1608]  5.81,90.79 356.4 bottom
R129  64k  [R1608]  5.81,102.21 3.6 bottom
R130  64k  [R1608]  7.11,113.55 10.8 bottom
R131  64k  [R1608]  9.96,124.62 18 bottom
R132  64k  [R1608]  124.62,9.95 252 bottom
R133  64k  [R1608]  113.55,7.11 259.2 bottom
R134  64k  [R1608]  102.21,5.68 266.4 bottom
R135  64k  [R1608]  90.79,5.68 273.6 bottom
R136  64k  [R1608]  79.45,7.11 280.8 bottom
R137  64k  [R1608]  68.38,9.95 288 bottom
R138  64k  [R1608]  162.37,96.5 180 bottom
R139  64k  [R1608]  170.75,96.5 180 bottom
R140  64k  [R1608]  96.5,30.62 270 bottom
R141  64k  [R1608]  96.5,22.25 270 bottom
R142  64k  [R1608]  96.5,13.87 270 bottom
R143  10k  [R1608]  104.08,112.85 0 top
R144  64k  [R1608]  179.12,96.5 180 bottom
R145  220  [R1608]  91,13.87 90 bottom
R146  10k  [R1608]  94.5,151.5 0 top
R147  10k  [R1608]  77.1,148.5 202.5 top
R148  10k  [R1608]  73.9,147 22.5 top
R149  10k  [R1608]  58.8,136.9 225 top
R150  10k  [R1608]  56.1,134.4 45 top
R151  10k  [R1608]  45.9,118.8 247.5 top
R152  10k  [R1608]  44.7,115.8 67.5 top
R153  10k  [R1608]  73.5,46.2 337.5 top
R154  10k  [R1608]  77.35,44.5 157.5 top
R155  10k  [R1608]  93.28,41.22 0 top
R156  10k  [R1608]  96.5,41.2 180 top
R157  10k  [R1608]  116.1,44.9 22.5 top
R158  10k  [R1608]  119.4,46.2 202.5 top
R159  10k  [R1608]  134.4,56.2 45 top
R160  10k  [R1608]  137,58.8 225 top
R161  10k  [R1608]  146.9,73.7 67.5 top
R162  10k  [R1608]  148.4,77.3 247.5 top
R163  10k  [R1608]  8.2,93.3 90 top
R164  10k  [R1608]  170.83,83.11 90 top
R165  10k  [R1608]  173.35,87.15 270 top
R166  10k  [R1608]  104.08,114.5 0 top
R167  10k  [R1608]  104.08,111.25 0 top
R168  10k  [R1608]  175.25,105.25 270 top
R169  10k  [R1608]  175.25,108.5 270 top
R170  10k  [R1608]  9.95,78.4 280.8 top
R171  10k  [R1608]  9.25,82.1 280.8 top
R172  220  [R1608]  102,13.87 90 bottom
R173  220  [R1608]  102,22.25 90 bottom
R174  10k  [R1608]  9.2,110.9 259.2 top
R175  10k  [R1608]  9.9,114.85 259.2 top
R176  10k  [R1608]  99.95,16.55 180 top
R177  10k  [R1608]  93.2,16.5 180 top
R178  10k  [R1608]  104.08,109.55 0 top
R180  10k  [R1608]  8,98.8 90 top
R181  10k  [R1608]  182.8,105 90 top
R182  10k  [R1608]  159.9,98.8 270 top
R183  10k  [R1608]  159.9,94.2 270 top
R184  10k  [R1608]  167.5,98.8 270 top
R186  10k  [R1608]  98.8,32.7 180 top
R187  10k  [R1608]  94.2,32.7 180 top
R189  10k  [R1608]  93.95,25.5 180 top
R190  10k  [R1608]  33,94.2 90 top
R191  10k  [R1608]  33,98.8 90 top
R192  10k  [R1608]  25.05,93.75 90 top
R194  10k  [R1608]  182.8,108.25 270 top
R195  10k  [R1608]  98.8,7.5 180 top
R196  64k  [R1608]  98.5,93.5 90 bottom
R197  10k  [R1608]  93.1,7.85 180 top
R198  220  [R1608]  94.5,93.5 270 bottom
R199  220  [R1608]  170.75,102.05 0 bottom
R200  220  [R1608]  162.37,102 0 bottom
R205  220  [R1608]  91,30.62 90 bottom
R206  10k  [R1608]  20.85,84.6 0 top
R207  10k  [R1608]  18.25,78.7 180 top
R208  220  [R1608]  179.12,91 0 bottom
R209  220  [R1608]  179.12,102 0 bottom
U1  AZ1117H-ADJTRE1SOT-223_DIO  [SOT-223_DIO]  91.45,127.95 180 top
U$3  RESETABLEFUSE  [R3216]  83.75,104.58 0 top
U$9  MCP4018T-503E/LT  [SOT65P210X110-6N]  94.74,123.75 90 top
U$27  SS2040FL  [SDO-123FL]  90,136.84 0 top
U$50  [JLCPCB]  64.5,94.5 0 top
U$57  SS2040FL  [SDO-123FL]  84.22,102.15 0 top
UART1  JST-XH-4PIN  [B4B-XH-A]  63.3,103 0 top

## Tracks (layer width: path | path; a pad name or v marks a point on that pad's centre or on a via)
1-1
  Top 0.2: 153.55,93.74 IC12.1 153.51,93.7 R6.1 151.46,93.7 149.02,96.14 arc45 145.97,97.4 137.76,97.4 137.75,97.39 113.66,97.39 110.13,100.92 105.75,100.92 arc45 105.1,100.65 arc-45 104.74,100.5 PIC32MK1024MCM100.48
1-2
  Top 0.2: IC12.7 arc-45 154.86,98.37 R12.2 151.75,95.54 151,96.3 149.98,97.33 arc45 146.42,98.8 117.07,98.8 arc-45 114.56,99.84 113.92,100.48 arc45 110.97,101.7 106.32,101.7 arc45 104.75,101.05 arc-45 104.39,100.9 PIC32MK1024MCM100.49
2-1  (via drill 0.35)
  Top 0.2: IC13.1 arc45 149.86,116.02 R14.1 146.43,116.02 arc-45 144.63,116.77 125.73,135.67 arc45 107.12,143.38 arc45 106.08,142.94 arc45 105.3,141.07 105.3,118.25 v104.6,117.55 | PIC32MK1024MCM100.47 100.9,100.1 v99.92,101.08
  Bottom 0.2: v104.6,117.55 104.6,106.4 99.92,101.72 v99.92,101.08
2-2  (via drill 0.35)
  Top 0.2: IC13.7 arc-45 149.6,120.82 149.6,120.7 arc-45 149.46,120.36 148.92,119.82 arc-45 147.13,119.08 R15.2 146.47,119.08 arc-45 144.17,120.03 127.63,136.57 arc45 108.06,144.67 arc45 104.5,143.2 104.21,142.91 arc45 103.5,141.2 103.5,119.6 v104.45,118.65 | PIC32MK1024MCM100.61 97.3,101.8 97.43,101.67 v97.43,101.65
  Bottom 0.2: v97.43,101.65 97.45,101.65 97.81,102.01 arc45 100.25,107.9 100.25,108.62 99.91,108.96 99.91,110.31 103.95,114.35 103.95,118.25 104.35,118.65 v104.45,118.65
3-1
  Top 0.2: IC14.1 arc45 138.3,134.75 R16.1 arc-45 136.94,133.62 134.04,133.62 arc-45 131.73,134.57 128.65,137.65 arc45 108.25,146.1 107.04,146.1 arc45 103.56,144.66 102.67,143.77 arc45 102.1,142.4 102.1,136.1 100.4,134.4 100.4,114.4 97.67,111.67 arc45 95.3,105.95 PIC32MK1024MCM100.66
3-2  (via drill 0.35)
  Top 0.2: IC14.7 arc-45 136.2,138.85 136.2,138.5 arc-45 136.1,138.25 R17.2 arc-45 134.2,136.6 v132.8,136.6 | PIC32MK1024MCM100.67 94.9,102.79 arc-45 v94.45,101.7
  Route15 0.2: v132.8,136.6 132.16,136.6 arc-45 126.77,138.83 124.42,141.18 arc45 115.19,145 107.18,145 arc45 106.04,144.52 arc45 105.35,142.87 105.35,112.31 arc-45 104.53,110.33 103.82,109.62 arc-45 99.07,107.65 98.69,107.65 arc45 96.57,106.77 95.19,105.39 arc45 94.45,103.6 v94.45,101.7
4-1  (via drill 0.35)
  Top 0.2: IC15.1 arc45 119.25,147.55 R21.1 118.75,147.07 arc-45 117.36,146.5 v116.4,146.5 | PIC32MK1024MCM100.68 94.5,107.23 v94.79,107.52
  Route15 0.2: v116.4,146.5 106.85,146.5 arc45 104.48,145.52 arc45 103.5,143.15 103.5,114.15 99.43,110.08 arc-45 98.27,109.6 97.25,109.6 arc45 95.71,108.96 94.79,108.04 v94.79,107.52
4-2  (via drill 0.35)
  Top 0.2: IC15.7 116.51,151.46 arc-45 116.9,151.3 arc-45 117.1,150.82 117.1,150.25 arc-45 116.36,148.46 R86.2 arc-45 116.32,148.42 116.12,148.22 arc-45 114.62,147.6 104.25,147.6 arc45 102.46,146.86 101.14,145.54 arc45 100.4,143.75 100.4,138.3 99,136.9 99,115.47 v97.6,114.08 | PIC32MK1024MCM100.72 92.95,103.29 92.95,104.08 93.13,104.26 93.13,106.91 92.15,107.89 v92.15,107.9
  Bottom 0.2: v92.15,107.9 92.75,107.9 97.6,112.75 v97.6,114.08
5-1  (via drill 0.35)
  Top 0.2: IC16.1 arc45 98.5,153.3 98.4,153.2 arc45 98.04,152.34 R87.1 98.04,150.36 v98.1,150.3 | PIC32MK1024MCM100.73 v92.5,105.07
  Route15 0.2: v98.1,150.3 100.09,148.31 arc-45 102.1,143.46 102.1,113.49 98.61,110 96,110 92.43,106.43 92.43,105.14 v92.5,105.07
5-2  (via drill 0.35)
  Top 0.2: IC16.7 arc-45 94.21,154.69 94.7,154.2 arc-45 94.96,153.58 R146.2 v94.96,150.1 | PIC32MK1024MCM100.74 92.1,104.55 91.45,105.2 v90.72,105.2
  Route15 0.2: v94.96,150.1 98.76,146.29 arc-45 100.4,142.34 100.4,114.65 arc-45 99.41,112.26 97.81,110.66 95.86,110.66 90.72,105.52 v90.72,105.2
6-1  (via drill 0.35)
  Top 0.2: v85.26,148.57 77.52,148.57 R147.1 arc-45 77,149.92 arc-45 IC17.1 | PIC32MK1024MCM100.76 89.1,101.3 88.1,102.3 88.1,103.65 arc-45 88.91,105.61 94.45,111.15 v95,111.15
  Route15 0.2: v85.26,148.57 85.29,148.6 91.32,148.6 arc-45 95.21,146.99 96.9,145.3 arc-45 99,140.23 99,116.8 arc-45 97.2,112.45 96.11,111.36 arc-45 95.6,111.15 v95,111.15
6-2  (via drill 0.35)
  Top 0.2: IC17.7 72.27,149.38 arc-45 73.2,149 73.82,148.37 arc-45 R148.2 74.93,146.57 arc45 v75.5,146.33 | PIC32MK1024MCM100.77 88.73,100.9 arc45 v88.25,100.7
  Route15 0.2: v75.5,146.33 90.15,146.33 arc-45 94.28,144.62 95.7,143.2 arc-45 97.3,139.34 97.3,117.57 arc-45 95.2,112.5 91.61,108.92 arc45 88.25,100.79 v88.25,100.7
7-1  (via drill 0.35)
  Top 0.2: IC18.1 arc45 58.39,137.95 R149.1 arc-45 59.3,136.8 60.15,135.94 arc45 61.46,135.4 v61.5,135.4 | v91.85,99.5 arc45 90.4,100.1 PIC32MK1024MCM100.79
  Bottom 0.2: v61.5,135.4 61.55,135.45 61.55,135.64 arc-45 85.83,145.7 91.33,145.7 arc-45 97.94,142.96 100.39,140.51 arc-45 102.1,136.38 102.1,120.16 arc-45 99.69,114.34 91.95,106.6 arc45 91.35,105.14 91.35,100.71 arc45 v91.85,99.5
7-2  (via drill 0.35)
  Top 0.2: IC18.7 arc-45 54.15,136.2 54.7,136.2 arc-45 55.12,136.03 R150.2 arc45 57.44,134.3 v58.2,134.3 | PIC32MK1024MCM100.78 91.71,100.5 arc45 91.95,100.6 arc45 91.96,100.61 arc45 91.98,100.61 arc45 91.99,100.61 arc45 v92,100.61
  Bottom 0.2: v58.2,134.3 arc45 58.54,134.44 61.06,136.96 arc-45 85.29,147 93.66,147 arc-45 99.36,144.64 101.93,142.07 arc-45 103.5,138.28 103.5,118.17 arc-45 101.93,114.38 97.58,110.03 arc-45 96.54,109.6 96.08,109.6 arc45 95,109.15 92.24,106.39 arc45 91.7,105.09 91.7,101.2 arc45 91.95,100.6 arc45 91.96,100.61 arc45 91.98,100.61 arc45 91.99,100.61 arc45 v92,100.61
8-1  (via drill 0.35)
  Top 0.2: IC19.1 44.79,120.59 arc45 45.2,119.6 45.23,119.57 arc45 R151.1 47.27,119.22 arc45 v47.7,119.4 | PIC32MK1024MCM100.80 88.68,99.7 arc-45 87.26,100.29 v87.25,100.3
  Bottom 0.2: v47.7,119.4 63.82,135.52 arc-45 85.5,144.5 88.53,144.5 arc-45 96.85,141.05 98.55,139.35 arc-45 100.4,134.88 100.4,119.7 arc-45 99.02,116.37 97.36,114.71 97.34,114.71 96.97,114.34 96.97,114.32 90.14,107.49 arc45 89.4,105.7 89.4,104.48 arc-45 88.53,102.38 87.82,101.67 arc45 v87.25,100.3
8-2  (via drill 0.35)
  Top 0.2: IC19.7 arc-45 41.69,116.69 41.89,116.89 arc-45 42.4,117.1 42.94,117.1 arc-45 44.74,116.36 R152.2 44.97,116.13 46.73,116.13 arc45 v46.8,116.1 | v86.4,100.85 v86.4,100.85 arc45 86.89,99.67 arc45 87.79,99.3 PIC32MK1024MCM100.81
  Bottom 0.2: v46.8,116.1 47.4,116.1 66.33,135.03 arc-45 86.3,143.3 86.69,143.3 arc-45 93.7,140.39 96.68,137.42 arc-45 98.9,132.06 98.9,122.51 arc-45 94.82,112.67 89.74,107.59 arc45 89,105.8 89,105.1 arc-45 87.83,102.28 v86.4,100.85
9-1
  Top 0.2: 39.51,99.26 arc45 IC20.1 41.89,99.21 R7.1 44.16,99.26 55.28,99.26 arc-45 56.75,98.65 57.48,97.92 arc45 59.22,97.2 73.6,97.2 arc-45 76.08,96.17 76.8,95.45 arc45 79.09,94.5 PIC32MK1024MCM100.93
9-2  (via drill 0.35)
  Top 0.2: PIC32MK1024MCM100.94 79.75,94.1 79.45,94.1 79.44,94.1 58.57,94.1 arc-45 56.91,94.79 56,95.7 arc45 52.36,97.21 v44.5,97.21 44.01,97.21 R8.2 | v39.65,95.2 39,95.2 38.13,94.33 IC20.7
  Bottom 0.2: v39.65,95.2 40.2,95.75 43.04,95.75 v44.5,97.21
10-1  (via drill 0.35)
  Top 0.2: IC21.1 arc45 42.98,77.42 R9.1 44.88,78.02 arc-45 45.81,77.63 47.69,75.76 arc-45 48.7,73.33 48.7,73.44 arc45 49.79,70.81 57.1,63.5 v57.1,63.3 | v87.2,90.5 arc-45 87.66,91.61 88,91.95 arc-45 89.33,92.5 PIC32MK1024MCM100.98
  Bottom 0.2: v57.1,63.3 57.1,63 64.13,55.97 arc45 88.38,45.93 arc45 90.59,46.84 arc45 94.25,55.68 94.25,79.55 arc45 92.8,83.05 87.94,87.91 arc-45 87.2,89.7 v87.2,90.5
10-2  (via drill 0.35)
  Top 0.2: IC21.7 43.62,72.27 arc-45 43.85,72.84 arc-45 R10.2 46.6,73.82 arc-45 46.9,73.7 47.04,73.56 47.17,73.51 47.22,73.37 47.41,73.19 arc-45 47.8,72.25 arc45 48.75,69.94 v55.3,63.4 | v88.5,90 88.5,91.46 arc-45 88.67,91.87 88.8,92 arc-45 89.04,92.1 PIC32MK1024MCM100.99
  Bottom 0.2: v55.3,63.4 55.3,62.7 63.07,54.93 arc45 88.14,44.55 arc45 91.67,46.01 arc45 95.75,55.85 95.75,80.84 arc45 94.78,83.16 88.89,89.06 arc-45 v88.5,90
11-1  (via drill 0.35)
  Top 0.2: IC22.1 arc-45 54.36,58.41 R11.1 arc-45 57.13,60.15 v58.8,60.15 | PIC32MK1024MCM100.4 92.9,85.35 arc-45 92.16,83.56 91.73,83.13 v91.73,83.09
  Route15 0.2: v58.8,60.15 58.85,60.15 arc-45 60.68,59.39 64.4,55.68 arc45 86.55,46.5 88.2,46.5 arc45 89.99,47.24 93.11,50.36 arc45 93.85,52.15 93.85,78.2 93.85,78.3 93.85,79.9 arc45 93.11,81.69 91.73,83.07 v91.73,83.09
11-2
  Top 0.2: IC22.7 56.85,53.61 56.85,55.2 R13.2 60.07,56.62 arc-45 61.87,55.88 65.98,51.77 arc45 74.24,48.35 85.31,48.35 arc45 87.7,49.34 arc45 88.7,51.75 88.7,74.11 arc-45 92.12,82.37 92.56,82.81 arc45 93.3,84.6 PIC32MK1024MCM100.5
12-1
  Top 0.2: IC23.1 arc-45 72.61,45.9 R153.1 73.42,46.71 arc-45 73.74,46.85 84.17,46.85 arc45 88.84,48.78 arc45 90.05,51.71 90.05,74.22 arc-45 93,81.35 93.1,81.45 arc45 93.7,82.9 PIC32MK1024MCM100.6
12-2
  Top 0.2: IC23.7 arc-45 76.23,41.72 76.01,41.94 arc-45 R154.2 76.95,45.24 arc-45 77,45.26 77.2,45.26 77.21,45.27 77.22,45.26 84.29,45.26 arc45 89.49,47.42 arc45 91.35,51.9 91.35,75.95 arc-45 92.09,77.74 93.31,78.96 arc45 94.05,80.75 94.05,89.71 PIC32MK1024MCM100.7
13-1  (via drill 0.35)
  Top 0.2: v97.65,82.2 arc45 97.72,82.03 98.8,80.95 arc-45 99.1,80.22 99.1,49.6 arc-45 98.78,48.83 92.43,42.48 R155.1 92.65,41 | v95.1,91.35 arc-45 95.36,91.24 95.55,91.05 arc-45 95.7,90.69 PIC32MK1024MCM100.11 | 92.67,41.15 92.65,41.15
  Top 0.305: IC24.1 92.65,40.54 92.65,41 92.65,41.15
  Route15 0.2: v97.65,82.2 95.84,84.01 arc-45 95.1,85.8 v95.1,91.35
13-2  (via drill 0.35)
  Top 0.2: IC24.7 arc-45 98.28,38.52 95.99,40.81 R156.2 95.65,42.1 arc-45 96.5,44.15 99.36,47.01 arc45 100.25,49.16 100.25,80.19 arc45 99.75,81.4 97.9,83.25 arc45 v97.3,83.5 | PIC32MK1024MCM100.12 96.1,91.48 arc-45 v96.15,91.6
  Route15 0.2: v96.15,91.6 arc45 95.5,90.03 95.5,86.35 arc45 96.24,84.56 v97.3,83.5
14-1  (via drill 0.35)
  Top 0.2: IC25.1 115.84,44.32 arc45 R157.1 115.6,44.8 v115.6,45.9 | v106.05,90.4 105.73,90.4 arc-45 103.69,91.24 PIC32MK1024MCM100.26
  Route15 0.2: v115.6,45.9 115.65,45.9 arc45 117.96,46.86 136.97,65.87 arc45 144.97,85.19 arc45 143.96,87.62 143.48,88.11 arc45 141.69,88.85 132.31,88.85 arc-45 130.51,89.59 v128.95,91.16 v128.95,91.17
  Bottom 0.2: v128.95,91.17 v128.94,91.18 128.82,91.18 127.01,92.98 arc45 126.13,93.35 113.82,93.35 arc45 109.69,91.64 108.89,90.84 arc-45 107.83,90.4 v106.05,90.4
14-2  (via drill 0.35)
  Top 0.2: IC25.7 120.59,43.62 arc-45 119.9,43.9 119.72,44.08 arc-45 118.98,45.87 R158.2 118.98,46.88 v119.8,47.7
  Route15 0.2: 146.5,85.03 arc45 145.35,87.8 143.44,89.71 arc45 141.65,90.45 132.7,90.45 arc-45 130.91,91.19 130.2,91.9 arc45 128.87,92.45 124.49,92.45 124.47,92.47 v124.45,92.47 | v119.8,47.7 119.84,47.7 arc45 123.18,49.08 139.36,65.26 arc45 146.5,82.5 146.5,84.38 146.44,84.44 146.44,84.97 146.5,85.03 | 146.5,85.03
  Bottom 0.2: v124.45,92.47 arc-45 124.45,92.49 arc45 124.45,92.45 arc-45 122.88,91.8 115.82,91.8 115.76,91.86 115.24,91.86 115.23,91.85 114,91.85 arc45 112.21,91.11 109.74,88.64 arc-45 107.95,87.9 v102.25,87.9
15-1  (via drill 0.35)
  Top 0.2: IC26.1 134.63,54.53 arc-45 R159.1 134.08,58.17 arc-45 135.56,61.76 139.26,65.46 arc45 143.28,75.17 143.28,79.96 143.19,80.05 143.19,80.57 143.28,80.67 143.28,85.68 arc45 142.74,86.99 arc45 141.03,87.7 131.06,87.7 arc-45 129.85,88.2 129.57,88.48 arc-45 v129.15,89.5 | PIC32MK1024MCM100.27 103.85,92.1 arc-45 104.45,91.85 104.51,91.79 arc45 106.3,91.05 v106.9,91.05
  Route15 0.2: v129.15,89.5 128.84,89.81 arc45 127.17,90.5 108.23,90.5 arc-45 v106.9,91.05
15-2  (via drill 0.35)
  Top 0.2: 139.8,57.15 arc-45 138.96,56.8 138.9,56.8 arc-45 137.97,57.19 R160.2 arc-45 136.82,60.02 139.86,63.06 arc45 144.9,75.22 144.9,80 144.89,80.01 144.89,80.53 144.9,80.54 144.9,85.37 arc45 143.84,87.94 arc45 141.03,89.1 131.94,89.1 v131.12,89.92 | PIC32MK1024MCM100.28 103.71,92.5 arc-45 104.8,92.05 arc45 105.64,91.7 106.99,91.7 arc-45 v108.2,91.2
  Top 0.305: 139.8,57.15 IC26.7
  Route15 0.2: v131.12,89.92 arc45 130.76,90.79 130.15,91.4 arc45 129.18,91.8 125.82,91.8 125.76,91.86 125.24,91.86 125.2,91.82 115.8,91.82 115.76,91.86 115.24,91.86 115.18,91.8 109.65,91.8 arc45 v108.2,91.2
16-1
  Top 0.2: IC28.1 arc-45 147.61,72.39 R161.1 146.23,73.25 arc-45 146.15,73.81 146.15,85.57 arc45 144.75,88.95 arc45 140.88,90.55 134.77,90.55 134.76,90.54 131.39,90.54 131.38,90.55 130.86,90.55 130.85,90.54 114.49,90.54 arc-45 112.13,91.51 110.22,93.43 arc45 107.64,94.5 PIC32MK1024MCM100.33
16-2
  Top 0.2: IC28.7 arc-45 151.24,76.14 151.1,76 arc-45 150.86,75.9 150.05,75.9 arc-45 148.24,76.65 R162.2 148.1,76.58 arc-45 147.7,77.54 147.7,77.72 147.7,85.04 arc45 145.77,89.69 arc45 140.69,91.8 113.67,91.8 arc-45 111.41,92.73 110.04,94.11 arc45 108.09,94.9 PIC32MK1024MCM100.34
+3.3V  (via drill 0.35)
  Top 0.2: R171.1 9.28,82.58 10.15,83.45 v10.55,83.45 | R2.2 95.82,129.12 v95.85,129.15 | C34.1 R156.1 | C34.1 98.96,41.09 98.96,39.65 arc-45 IC24.8 | C34.1 arc45 98.55,41.34 98.55,42.32 v98.32,42.55 | v94.6,42.8 arc45 94.1,41.59 94.1,41.26 R155.2 | R16.2 arc-45 137,135.2 v137.4,135.6 | R15.1 arc45 147.81,120.45 IC13.8 147.22,121.85 arc-45 C23.1 arc45 146.87,122.7 v148.05,122.7 | R14.2 147.25,115.18 arc-45 v147.2,115.2 | R13.1 58.04,55.1 IC22.8 58.91,54.21 C32.1 59.38,53.13 v58.85,52.6 | R153.2 73.7,45.8 v73.7,44.55 | R154.1 78.11,44.17 78.11,43.66 IC23.8 78.54,42.71 C33.1 79.06,41.76 v78.4,41.1 | R146.1 94.04,150.14 v94,150.1 | R87.2 98.96,150.44 v99.15,150.25 | R162.1 149.99,77.45 IC28.8 150.4,77.27 C37.1 151.25,78.95 v151.95,78.25 | R161.2 148.13,74.12 v148.7,73.55 | v140.65,58.7 139.87,59.48 C36.1 138.79,58.69 IC26.8 138.4,58.04 R160.1 | R159.2 134.72,58.42 v134.74,58.44 | R157.2 116.52,46.82 v116.6,46.9 | C35.1 122.11,46.05 IC25.8 120.85,45.69 120.13,46.41 R158.1 | v109.25,96.15 108.75,95.65 106.8,95.65 C6.1 105.55,96.1 PIC32MK1024MCM100.37 | Q2.1 21.25,83 R206.2 22,84.3 v22.8,84.3 | IC5.8 arc45 176.21,110.95 C43.1 175.2,109.4 R169.1 175.25,110.18 arc45 175.2,110.3 173.83,110.3 v173.79,110.33 | R168.2 arc45 175.11,104.85 v173.95,104.85 | v89.9,87.1 arc-45 90.01,87.15 90.27,87.4 C1.1 92.1,88.15 PIC32MK1024MCM100.2 | R174.2 arc-45 10.13,110.17 v10.25,110.05 | R195.2 97.6,7.85 v97.6,9.6 | v94.97,6.59 94.91,6.59 93.95,7.55 R197.1 | IC3.8 17.78,98.15 C40.1 15.89,98.19 v15.8,98.1 | IC32.8 25.24,99.21 C45.1 24.56,99.1 v23.8,99.1 | v84.25,97.73 84.25,97.64 84.54,97.35 86.65,97.35 C10.1 88.2,97.3 PIC32MK1024MCM100.86
  Top 0.2: PIC32MK1024MCM100.62 C9.2 96.15,106.04 96.15,107.97 v96.29,108.12 | PIC32MK1024MCM100.55 99.7,104.85 C8.1 99.68,105.74 102.34,105.74 v103.6,107 | PIC32MK1024MCM100.30 105.4,93.3 C5.2 106.5,94 108.45,94 109.6,92.85 v109.6,92.45 | PIC32MK1024MCM100.16 97.7,86.7 C2.2 97.76,86.58 R3.2 95.8,84.62 v95.8,83.15 | IC20.8 39.59,93.6 C30.1 v41.25,94.7 R8.1 41.25,98.05 R7.2 | 151.95,97.1 151.9,97.1 R12.1 151.75,98.05 v151.8,98.1 151.8,99.2 C22.1 152.09,99.21 IC12.8 | R165.1 172.31,89.04 v172.31,89.46 | R164.2 170.74,84.05 v170.74,85.2 170.74,86.35 C14.1 170.75,86.2 172.57,84.38 IC27.8 | R6.2 v148.7,95.05 | PIC32MK1024MCM100.46 105.3,99.7 C7.1 106.3,100.5 108.77,100.5 109.79,99.48 v109.91,99.48
  Top 0.305: v124.15,47.15 C35.1 | U$9.1 94.08,121.33 | 94.08,121.33 94.08,121.29 | IC6.8 arc-45 3.36,82.5 C18.1 4.41,83.56 arc45 v4.5,83.6 | v11.25,77.77 11.05,77.56 arc-45 R170.2 | v95.47,118.35 95.45,118.35 95.45,119.84 R4.2 94.96,120.04 94.2,120.8 C17.2 94.08,121.33 | v11.35,115.4 10.66,115.68 arc45 R175.1 | R86.1 115.48,149.4 arc-45 IC15.8 114.79,150.29 arc-45 C25.1 arc-45 113.79,150.89 v114.5,151.6 | R21.2 119.46,146.56 arc45 v119.1,145.7 | v134.05,140.5 arc45 133.56,140.3 C24.1 133.6,139.35 arc45 IC14.8 arc-45 134.68,138.13 R17.1 | IC8.8 4.77,117.26 arc-45 C15.1 5.56,118.59 arc45 v6.5,118.2 | IC16.8 93.59,153.59 C26.1 91.88,153.15 v92.1,152.93 | v68.7,145.85 69.17,146.32 C27.1 71.78,148.21 IC17.8 R148.1 | R147.2 v77.15,147.15 | v51.75,131.5 C28.1 IC18.8 R150.1 | R149.2 57.4,137.65 v57.1,137.65 | v41.7,111.52 42.25,112.06 C29.1 42.25,115.38 IC19.8 44.06,115.84 R152.1 | R151.2 45.85,118.25 v47,118.25 | R9.2 44.87,76.82 v44.05,76 | R10.1 45.62,72.98 IC21.8 46.15,70.79 C31.1 47.4,69.05 v47.4,68.75 | R11.2 56.02,57.72 v55.45,57.15 | IC30.8 arc45 173.86,93.7 C42.1 arc-45 v176.5,93.35 | IC33.8 arc45 183.34,110.69 C46.1 R194.1 182.52,108.82 181.51,108.82 v180.95,109.38 | IC11.8 2.9,99.52 C38.1 2.9,101.2 1.92,102.18 1.92,104 v1.96,104.04 | R180.1 7.49,98.34 v6.95,97.8 | v158.7,95.1 159.85,95.1 R183.1 | 159.9,97.55 R182.2 158.95,97 v158.95,96.5 | R184.2 167.5,96.6 v167.4,96.5 | IC2.8 166.02,93.55 C19.1 167.5,92.26 v167.48,92.24 | IC9.8 92.02,10.47 C20.1 91.39,9.64 89.8,9.64 v88.85,10.6 | R176.2 99.1,16.65 v97.95,17.8 | IC29.8 93.79,17.48 R177.1 C41.1 95.9,15.92 v95.26,15.29 | IC31.8 94.41,26.6 R189.1 C44.1 96.67,25.42 v95.35,26.75
  Top 0.305: R187.1 v95.05,33.8 | R186.2 97.8,32.7 97.5,33 97.35,33 v96.75,33.6 | v9.68,94.61 8.31,94.61 R163.2 | R192.2 24.55,94.35 v23.9,94.35 | v34.15,94.5 33.6,95.05 R190.2 | R191.1 32.97,97.97 32.8,97.8 v31.7,97.8 | v88.85,1.97 88.98,1.84 90.94,1.84 C48.1 92.3,2.09 IC34.8 | R181.2 181.75,105.85 v181.7,105.9 | R1.2 176.62,68.37 v176.55,68.3
  Top 1.016: C4.1 91.02,119.53 IC1.2
  Bottom 0.2: 37.1 39.3,73.56 v39.3,74.1 | 55.1 97.17,10.02 v97.6,9.6 | 60.1 17.4,96.5 v15.8,98.1 | 59.1 v25.5,96.5
  Bottom 0.305: 7.1 v6,68.3 | 8.1 v3.2,79.9 | 11.1 v3.7,115.4 | 12.1 v6.8,126.9 | v35.15,97.74 35.1 | 34.1 36.6,108.72 v36.6,109.5 | 33.1 40.2,120.34 v40.2,120.95 | 32.1 45.95,131.04 45.95,131.54 45.99,131.54 v46.07,131.47 | 31.1 53.9,140.53 v53.9,140.6 | 30.1 63.15,148.1 v63.3,148.1 | 29.1 73.45,153.55 v74.1,153.55 | 28.1 84.77,156.9 v85.6,156.9 | 27.1 v96.5,159 | 26.1 109.44,156.66 v109.6,156.5 | 25.1 120.61,153.14 v121,152.75 | 24.1 130.88,147.42 v131.45,146.85 | 23.1 140.53,139.1 v140.65,139.1 | 22.1 147.95,130.14 v147.95,129.6 | 21.1 153.17,119.43 v153.6,119 | 20.1 156.66,107.69 v156.9,107.45 | 38.1 45.57,62.35 45.57,61.94 v46.12,61.39 | 39.1 52.37,54 v52.35,54 | 41.1 72.28,39.95 v71.98,40.25 | 6.1 187.25,125.19 v187.25,124.71 | 5.1 189.95,113.83 v189.95,113.14 | 4.1 191.17,102.63 191.1,103.63 v191.07,103.63 | 3.1 191.07,90.48 v191.07,89.37 | 2.1 189.53,79.98 v189.55,80 | 1.1 186.65,68.05 v186.95,68.35 | 50.1 156.66,85.66 v156.7,85.7 | 49.1 153.17,73.57 v153.65,74.05 | 48.1 147.5,62.6 148.18,63.28 v148.18,63.42 | 47.1 140.58,53.95 v140.6,53.95 | 46.1 131.16,46.25 v131.5,46.25 | 45.1 119.35,39.95 v118.95,39.55 | v63.43,44.82 63.27,44.82 40.1 | 44.1 107.67,36.46 v107.19,36.94 | 42.1 84.56,36.71 v83.35,36.71 | 36.1 36.34,83.19 v36.47,83.07 | 63.1 v98.5,98.5 | 18.1 v68.4,5.95 | v79.95,3.2 17.1 | 15.1 101.26,2.01 v101.25,2 | 14.1 113.07,3.47 v113.05,3.45 | 13.1 125.34,5.9 v124.55,5.9 | v1.96,104.04 1.96,102.49 10.1 | 9.1 1.8,90.77 v1.8,91.9 | v184.2,96.5 57.1 | 19.1 v158.95,96.5 | 51.1 v167.4,96.5 | 52.1 v175.75,96.5 | 16.1 90.52,1.97 v88.85,1.97 | 54.1 97.35,18.4 v97.95,17.8 | 53.1 96.47,26.75 v95.35,26.75 | v10.02,97.6 61.1 | v97.77,34.89 96.76,34.89 43.1
  other vias: 148.6,82.6 83.5,153.2 127.45,145.7 89.9,114.9 90.9,114.9 91.9,114.9 92.9,114.9 89.9,116.9 90.9,116.9 91.9,116.9 92.9,116.9 90.4,115.9 91.4,115.9 92.4,115.9
  pour Route2 (no thermals): -25.42,-12.42 218.42,-12.42 218.42,166.42 -25.42,166.42
  pour Top (no thermals): 90.88,118.78 90.86,118.76 89.58,117.47 89.58,111.98 93.32,111.98 93.32,117.57 92.04,118.86 92.02,118.88 92.02,120.02 90.88,120.02
+5V
  Top 1.27: J2.1 79.98,104.58 U$3.1
ANALOG-1  (via drill 0.35)
  Top 0.2: PIC32MK1024MCM100.14 96.9,93.4 v97.2,93.7
  Bottom 0.2: R196.2 98.5,94.5 arc45 97.65,94.15 v97.2,93.7
  Bottom 0.305: R196.2 63.2
B1  (via drill 0.35)
  Top 0.2: v105.5,43.15 105.5,41.19 arc-45 104.91,39.76 102.69,37.54 arc45 101.3,34.18 101.3,17.85 100.8,17.35 R176.1 | PIC32MK1024MCM100.21 99.7,90.46 arc-45 99.8,90.7 arc-45 100.16,90.85 100.95,90.85 arc-45 103.09,89.96 104.35,88.7 v104.35,88.58
  Top 0.305: IC9.1 100.07,10.47 100.4,10.8 100.4,16.15 R176.1
  Route15 0.2: v105.5,43.15 arc-45 105.35,43.51 105.35,87.31 arc45 105.16,87.77 arc45 v104.35,88.58
B1-IN  (via drill 0.35)
  Top 0.2: IC9.2 98.54,11.74 98.1,11.3 98.1,10 98.5,9.6 100.03,9.6 100.93,10.5 103.22,10.5 v104.13,9.58
  Top 0.305: v123.5,8.5 v112.05,5.55
  Bottom 0.305: 13.2 R132.2 124.24,8.5 v123.5,8.5 | R133.2 14.2 113.86,5.2 112.4,5.2 v112.05,5.55 107.82,9.78 104.33,9.78 v104.13,9.58
B2  (via drill 0.35)
  Top 0.2: PIC32MK1024MCM100.20 99.3,89.36 arc45 100.37,86.78 102.11,85.04 arc-45 102.85,83.25 102.85,47.97 arc45 103.5,46.4 arc-45 103.8,45.68 103.8,40.8 arc-45 103.06,39.01 100.75,36.7 100.75,27.89 100.75,27.51 arc-45 99.86,25.35 98.35,23.84 94.16,23.84 v93.65,24.35
  Top 0.305: IC9.7 93.06,11.74 92.55,12.25 92.55,16.2 R177.2 92.95,16.8 v92.95,17.55
  Bottom 0.305: v92.95,17.55 92.95,23.65 v93.65,24.35
B2-IN  (via drill 0.35)
  Top 0.2: IC9.6 93.99,13.01 94.8,12.19 94.8,10.01 94.03,9.24 89.01,9.24 v88.6,9.65
  Top 0.305: v69.7,8.4 75.4,8.4 v77.85,10.85 v77.85,10.84 80.85,7.85 v80.85,6.3
  Route15 0.305: v77.85,10.84 78.71,11.7 86.55,11.7 v88.6,9.65
  Bottom 0.305: v80.85,6.3 79.31,6.3 | 79.31,6.3 R136.2 | 17.2 79.31,6.3 | 18.2 67.87,8.38 | 67.87,8.38 R137.2 | v69.7,8.4 67.89,8.4 67.87,8.38
B3  (via drill 0.35)
  Top 0.2: PIC32MK1024MCM100.19 98.9,88.25 arc45 99.54,86.71 v100.8,85.45 | IC34.1 99.74,2.09 100.3,2.65 100.3,6.46 R195.1 99.26,7.86 101.07,9.67 v101.07,9.75
  Route15 0.2: v105.95,36 105.15,36 arc45 103.36,35.26 101,32.9 arc45 100.04,30.58 100.04,10.86 101.07,9.83 v101.07,9.75
  Bottom 0.2: v105.95,36 104.54,37.41 arc-45 103.8,39.2 103.8,45.45 arc-45 104.54,47.24 105.1,47.8 arc45 105.35,48.4 105.35,79.85 arc45 104.61,81.64 v100.8,85.45
B3-IN  (via drill 0.35)
  Top 0.305: IC34.2 99.18,3.4 v97.7,3.4
  Bottom 0.305: R134.2 15.2 98.01,3.71 v97.7,3.4
B4  (via drill 0.35)
  Top 0.2: PIC32MK1024MCM100.18 98.5,88.19 arc45 99.45,85.9 v100.85,84.5
  Top 0.305: IC34.7 93.18,3.36 92.72,3.83 92.72,7.38 R197.2 92.47,7.85 93.27,8.65 94.01,8.65 95.47,10.11 v95.47,12.65
  Route15 0.2: v88.9,36.35 94.45,30.8 94.45,13.67 v95.47,12.65
  Bottom 0.2: v88.9,36.35 88.9,39.05 arc-45 90.67,43.32 100.73,53.38 arc45 102.85,58.5 102.85,81.01 arc45 101.79,83.55 v100.85,84.5
B4-IN  (via drill 0.35)
  Top 0.305: v95.25,4.55 95.16,4.63 IC34.6
  Bottom 0.305: 16.2 90.69,4.21 | 90.69,4.21 R135.2 | v95.25,4.55 94.91,4.21 90.69,4.21
BB1
  Top 0.2: PIC32MK1024MCM100.9 94.9,82.98 arc45 95.45,81.65 95.51,81.59 arc-45 95.75,81 95.75,50.55 arc-45 94.97,48.67 92.84,46.54 arc45 91.6,43.54 91.6,35.45 arc45 91.87,34.8 arc45 92.52,34.53 95.26,34.53 95.29,34.5 96.21,34.5 arc-45 99.01,33.34 R186.1 arc-45 99.84,32.46 100.02,32.28 arc-45 100.4,31.37 100.4,28.04 arc-45 100.2,27.55 100.15,27.5 arc-45 99.47,27.22 IC31.1
BB2
  Top 0.2: PIC32MK1024MCM100.8 94.45,89.71 94.45,78.6 arc-45 93.92,77.32 93.9,77.3 arc45 93.5,76.33 93.5,51.65 arc-45 92.12,48.32 91.56,47.76 arc45 90.15,44.36 90.15,36.65 90.15,36.1 arc45 90.89,34.31 91.76,33.44 arc45 93.55,32.7 R187.2 arc45 93.33,32.53 92.85,32.05 arc45 92.6,31.45 92.6,29.38 arc45 92.8,28.9 92.8,28.9 arc45 IC31.7
BB3  (via drill 0.35)
  Top 0.2: PIC32MK1024MCM100.22 100.1,89.6 arc45 101.55,86.1 103.36,84.29 arc-45 104.15,82.38 104.15,49.18 arc45 104.84,47.51 105.46,46.89 arc-45 106.2,45.1 106.2,40.85 arc-45 105.46,39.06 103.85,37.45 v103.85,36.55 | IC29.7 93.33,20.11 92.65,20.8 92.65,23 | 92.65,23 93.14,23.49 98.84,23.49 99.29,23.93 v99.33,23.93 | 92.65,23 92.65,24.07 92.75,24.17 92.75,25.15 R189.2
  Bottom 0.2: v103.85,36.55 103.85,35.73 99.5,31.38 99.5,24.14 99.33,23.97 v99.33,23.93
BR1-IN  (via drill 0.35)
  Top 0.305: v97.8,28.45 99.17,28.45 IC31.2
  Bottom 0.305: R140.2 53.2 97.77,28.47 v97.8,28.45
BR2-IN  (via drill 0.35)
  Top 0.305: v95.25,28.25 95.25,28.9 94.39,29.76 IC31.6
  Bottom 0.305: 54.2 R141.2 94.52,23.38 94.52,27.52 v95.25,28.25
BR3-IN  (via drill 0.35)
  Top 0.305: IC29.6 94.21,21.38 95.3,20.29 v95.3,20.1
  Bottom 0.305: 55.2 R142.2 97.4,13.92 97.4,15.9 95.3,18 v95.3,20.1
DAC  (via drill 0.35)
  Top 0.2: IC26.3 136.92,52.52 IC26.5 146.09,60.6 IC28.3 IC28.5 arc45 154.3,76.89 v154.3,77.2 | IC12.3 arc45 156,93.46 156,92.47 v155.96,92.47 | 93.3,102.4 93.05,102.15 89.92,102.15 R22.2 | 93.3,102.4 PIC32MK1024MCM100.71 | 93.3,102.4 93.3,100.9 v93.35,100.85 | IC27.3 175.11,80.16 176.38,81.43 176.38,83.9 IC27.5
  Top 0.305: 136.92,52.52 IC25.5 IC25.3 116.78,40.33 arc-45 v115.5,39.8 | IC24.3 v95.2,36.5 v97.63,35.95 IC24.5 | v76.9,38.5 arc-45 76.03,38.86 IC23.5 IC23.3 59.46,48.23 IC22.5 IC22.3 45.03,63.63 IC21.5 IC21.3 v39.8,77.6 | IC20.5 v35.6,95.3 35.6,95.5 35.6,96.13 v36.26,97.76 36.85,99.19 IC20.3 | v38.9,115.6 IC19.5 IC19.3 IC18.5 IC18.3 IC17.5 IC17.3 89.5,157.41 89.5,157.4 IC16.5 IC16.3 IC15.5 IC15.3 IC14.5 IC14.3 IC13.5 IC13.3 v153.05,115.35 | 157.14,97.81 IC12.5 | 157.14,97.81 157.11,97.63 156.55,95.28 | 156.55,95.28 IC12.3 | 156.55,95.28 v156.55,95.33 | IC6.3 7.45,82.49 IC6.5 v7.15,83.9 | IC8.5 8.5,116.62 6.25,111.08 IC8.3 6.05,110.76 v6.05,109.35 | 157.14,97.81 157.07,97.74 v157.07,97.72 | 179.38,103.48 179.38,103.38 v179.45,103.45 | 179.38,103.48 IC5.3 IC5.5 | IC33.5 IC33.3 187.13,103.98 186.25,103.1 179.77,103.1 179.38,103.48 | IC11.3 5.31,94.54 v5.46,95.18 | v5.46,95.18 v6.03,97.61 IC11.5 | IC2.5 v162.33,95.33 IC2.3 | IC30.3 v170.22,95.39 IC30.5 arc45 170.27,92.76 176.38,86.65 176.38,83.9 | IC31.3 95.53,30.62 v95.19,30.7 IC31.5 | IC29.3 v97.65,21.75 IC29.5 | IC34.3 96.15,5.35 95.7,5.46 | 95.7,5.46 95.65,5.47 IC34.5 | IC9.3 v95.27,13.93 | v95.27,13.93 IC9.5 | v95.27,13.93 96.25,12.95 96.25,9.3 95.7,8.75 95.7,5.46 | IC32.3 v30.11,95.3 IC32.5 | IC3.3 v21.74,95.29 | v21.74,95.29 IC3.5 | v21.74,95.29 5.57,95.29 v5.46,95.18
  Route15 0.2: v97.63,35.95 114.05,39.45 v115.5,39.8 | v155.96,92.47 155.96,81.7 154.68,77.58 v154.3,77.2